# Altium project ANTS-PCU-B1.PrjPcb (part 2 of 2)

## Sheet POWER_RAIL_MONITORING.SchDoc
size B
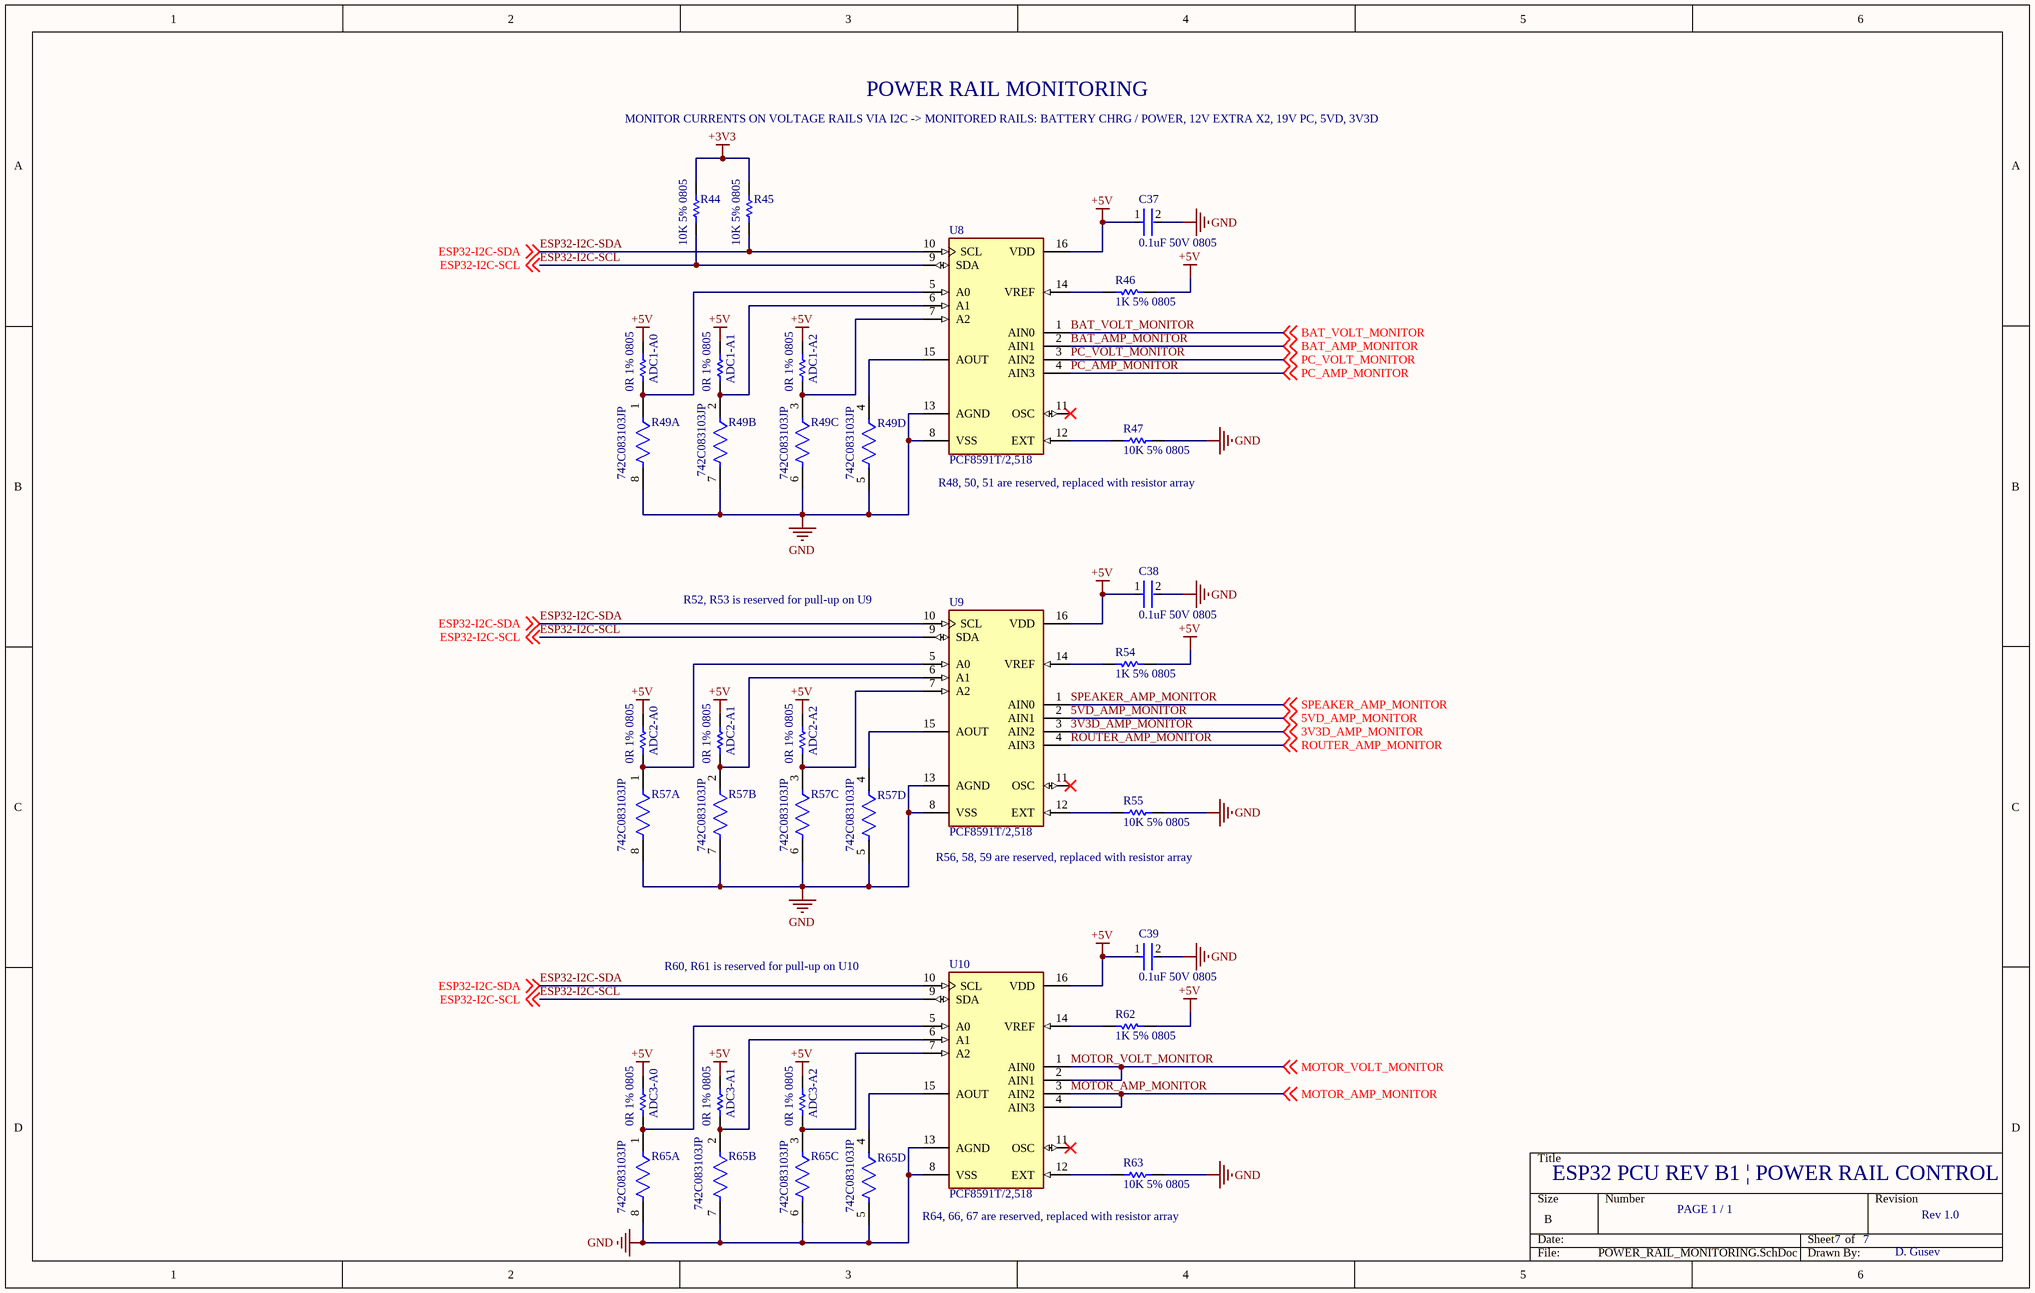
[diagram p6: POWER_RAIL_MONITORING.SchDoc]

### Parts
ADC1-A0  0R 1% 0805  [RESC2013X60X35LL10T20]
ADC1-A1  0R 1% 0805  [RESC2013X60X35LL10T20]
ADC1-A2  0R 1% 0805  [RESC2013X60X35LL10T20]
ADC2-A0  0R 1% 0805  [RESC2013X60X35LL10T20]
ADC2-A1  0R 1% 0805  [RESC2013X60X35LL10T20]
ADC2-A2  0R 1% 0805  [RESC2013X60X35LL10T20]
ADC3-A0  0R 1% 0805  [RESC2013X60X35LL10T20]
ADC3-A1  0R 1% 0805  [RESC2013X60X35LL10T20]
ADC3-A2  0R 1% 0805  [RESC2013X60X35LL10T20]
C37  0.1uF 50V 0805  [FP-C0805C-DN-MFG]
C38  0.1uF 50V 0805  [FP-C0805C-DN-MFG]
C39  0.1uF 50V 0805  [FP-C0805C-DN-MFG]
R44  10K 5% 0805  [RESC2013X60X40ML20T25]
R45  10K 5% 0805  [RESC2013X60X40ML20T25]
R46  1K 5% 0805  [RESC2013X60X40ML20T25]
R47  10K 5% 0805  [RESC2013X60X40ML20T25]
R49  742C083103JP  [FP-742C083-MFG]  (parts A,B,C,D of 4)
R54  1K 5% 0805  [RESC2013X60X40ML20T25]
R55  10K 5% 0805  [RESC2013X60X40ML20T25]
R57  742C083103JP  [FP-742C083-MFG]  (parts A,B,C,D of 4)
R62  1K 5% 0805  [RESC2013X60X40ML20T25]
R63  10K 5% 0805  [RESC2013X60X40ML20T25]
R65  742C083103JP  [FP-742C083-MFG]  (parts A,B,C,D of 4)
U8  PCF8591T/2,518  [FP-SOT162-1-MFG]
U9  PCF8591T/2,518  [FP-SOT162-1-MFG]
U10  PCF8591T/2,518  [FP-SOT162-1-MFG]

### Nets
+3V3: R44.2 R45.2
+5V: ADC1-A0.1 ADC1-A1.1 ADC1-A2.1 ADC2-A0.1 ADC2-A1.1 ADC2-A2.1 ADC3-A0.1 ADC3-A1.1 ADC3-A2.1 C37.1 C38.1 C39.1 R46.2 R54.2 R62.2 U8.16(VDD) U9.16(VDD) U10.16(VDD)
GND: C37.2 C38.2 C39.2 R47.2 R49.5 R49.6 R49.7 R49.8 R55.2 R57.5 R57.6 R57.7 R57.8 R63.2 R65.5 R65.6 R65.7 R65.8 U8.8(VSS) U8.13(AGND) U9.8(VSS) U9.13(AGND) U10.8(VSS) U10.13(AGND)
3V3D_AMP_MONITOR: U9.3(AIN2) ; off-sheet 3V3D_AMP_MONITOR
5VD_AMP_MONITOR: U9.2(AIN1) ; off-sheet 5VD_AMP_MONITOR
BAT_AMP_MONITOR: U8.2(AIN1) ; off-sheet BAT_AMP_MONITOR
BAT_VOLT_MONITOR: U8.1(AIN0) ; off-sheet BAT_VOLT_MONITOR
ESP32-I2C-SCL: R44.1 U8.9(SDA) U9.9(SDA) U10.9(SDA) ; off-sheet ESP32-I2C-SCL
ESP32-I2C-SDA: R45.1 U8.10(SCL) U9.10(SCL) U10.10(SCL) ; off-sheet ESP32-I2C-SDA
MOTOR_AMP_MONITOR: U10.3(AIN2) U10.4(AIN3) ; off-sheet MOTOR_AMP_MONITOR
MOTOR_VOLT_MONITOR: U10.1(AIN0) U10.2(AIN1) ; off-sheet MOTOR_VOLT_MONITOR
PC_AMP_MONITOR: U8.4(AIN3) ; off-sheet PC_AMP_MONITOR
PC_VOLT_MONITOR: U8.3(AIN2) ; off-sheet PC_VOLT_MONITOR
ROUTER_AMP_MONITOR: U9.4(AIN3) ; off-sheet ROUTER_AMP_MONITOR
SPEAKER_AMP_MONITOR: U9.1(AIN0) ; off-sheet SPEAKER_AMP_MONITOR
NetADC1-A0_2: ADC1-A0.2 R49.1 U8.5(A0)
NetADC1-A1_2: ADC1-A1.2 R49.2 U8.6(A1)
NetADC1-A2_2: ADC1-A2.2 R49.3 U8.7(A2)
NetADC2-A0_2: ADC2-A0.2 R57.1 U9.5(A0)
NetADC2-A1_2: ADC2-A1.2 R57.2 U9.6(A1)
NetADC2-A2_2: ADC2-A2.2 R57.3 U9.7(A2)
NetADC3-A0_2: ADC3-A0.2 R65.1 U10.5(A0)
NetADC3-A1_2: ADC3-A1.2 R65.2 U10.6(A1)
NetADC3-A2_2: ADC3-A2.2 R65.3 U10.7(A2)
NetR46_1: R46.1 U8.14(VREF)
NetR47_1: R47.1 U8.12(EXT)
NetR49_4: R49.4 U8.15(AOUT)
NetR54_1: R54.1 U9.14(VREF)
NetR55_1: R55.1 U9.12(EXT)
NetR57_4: R57.4 U9.15(AOUT)
NetR62_1: R62.1 U10.14(VREF)
NetR63_1: R63.1 U10.12(EXT)
NetR65_4: R65.4 U10.15(AOUT)

Not connected (* = marked no-connect by the designer): U8 11(OSC)*; U9 11(OSC)*; U10 11(OSC)*

### Notes on the sheet
- POWER RAIL MONITORING
- MONITOR CURRENTS ON VOLTAGE RAILS VIA I2C -> MONITORED RAILS: BATTERY CHRG / POWER, 12V EXTRA X2, 19V PC, 5VD, 3V3D
- R48, 50, 51 are reserved, replaced with resistor array
- (near U9) R52, R53 is reserved for pull-up on U9
- R56, 58, 59 are reserved, replaced with resistor array
- (near U10) R60, R61 is reserved for pull-up on U10
- R64, 66, 67 are reserved, replaced with resistor array
- ESP32 PCU REV B1 | POWER RAIL CONTROL
- PAGE 1 / 1
- 7
- Rev 1.0
- D. Gusev

### Library data of the parts
ADC1-A0-ADC1-A2 ADC2-A0-ADC2-A2 ADC3-A0-ADC3-A2 = CMP-1659-00014-4: Chip Resistor, 1 Ohm, +/- 1%, 125 mW, -55 to 155 degC, 0805 (2012 Metric), RoHS, Tape and Reel; Manufacturer: Yageo; Voltage Rating: 150 V; REACH SVHC: No SVHC; Mounting Technology: Surface Mount; RoHSCompliant: true; Packaging: Tape and Reel; ComponentLink2URL: http://www.yageo.com/documents/recent/PYu-RC_Group_51_RoHS_L_04.pdf; Pins: 2; Package Quantity: 5000; DatasheetVersion: Rev. 4, 02/2016; Mount: Surface Mount; Max Operating Temperature: 155 degC; PackageDescription: 2-Pin Surface Mounted Device, Body 2 x 1.25 mm; PackageReference: 0805; Length: 2 mm; Min Operating Temperature: -55 degC; ComponentLink1URL: http://www.yageo.com/; Height: 0.5 mm; ComponentLink1Description: Manufacturer URL; ComponentLink2Description: Datasheet
C37-C39 = CMP-2007-00279-2: CAP CER 0.1UF 50V X7R 0805; Manufacturer Part Number: C0805C104K5RACTU; Manufacturer: KEMET; Value: 0.10 μF; Tolerance: 0.1; Temperature Coefficient: 30ppm/°C; Material: Ceramic; Device Class L2: Capacitors; Temperature Range Low: -55°C; Voltage Rating: 50 V; Digikey Description: CAP CER 0.1UF 50V X7R 0805; Category: Cap; ComponentLink2Description: Datasheet; Octopart: https://octopart.com/c0805c104k5ractu-kemet-143926; RoHS: TRUE; ComponentLink2URL: https://content.kemet.com/datasheets/KEM_C1003_C0G_SMD.pdf; Temperature Characteristic: X7R; Temperature: -55°C to +125°C; Height: 0.88mm; Temperature Range High: +125°C; Device Class L1: Passive Components; Automotive: No; Lead Free: Yes; Ipc Land Pattern Name: CAPC200125X78; Device Class L3: Ceramic Capacitors; Mouser Description: Cap Ceramic 0.1uF 50V X7R 10% SMD 2.0 x 1.2 mm 125 C Paper T/R; Capacitance: 0.10 μF; Package: C0805C-DN
R44-R47 R54 R55 R62 R63 = CMP-2001-00590-1: Part Number: ERA6AEB123V; Manufacturer: Panasonic
R49 R57 R65 = CMP-06828-000005-1: RES ARRAY 4 RES 10K OHM 1206; Number of Elements: 4; Circuit Type: Isolated; Power Rating: 250mW; Working Voltage: 50V; Temperature Coefficient: 200ppm/°C; Tolerance: 5%; Resistance: 10kR; Power Per Element: 62.5mW; Power Dissipation: 63mW; Min Operating Temperature: -55°C; Height: 0.028inch; Number of Terminals: 8; Width: 0.063inch; Depth: 1.6mm; Max Operating Temperature: 125°C; Termination: Concave; Lead Free: Lead Free; Mount: Surface Mount; Package Quantity: 1; Military Standard: Not; Radiation Hardening: No; Contact Plating: Tin; Case Code (Metric): 3216; Terminal Pitch: 0.8mm; Number of Pins: 8; Case/Package: 0603; Case Code (Imperial): 1206; Length: 3.2mm; Packaging: Tape and Reel; Number of Resistors: 4
U8-U10 = CMP-10085-000001-1: IC ADC/DAC 8BIT 11.1K 16SO; Manufacturer: NXP Semiconductors; Standoff Height: 0.1mm; Interface: I2C; Nominal Supply Current: 125-450uA; Max Supply Voltage: 6V; Min Supply Voltage: 2.5V; Octopart: https://octopart.com/pcf8591t%2F2%2C518-nxp+semiconductors-7871876; Lead Free: Yes; Mouser Description: PCF8591 Series 2.5 V - 6 V 8-bit A/D and D/A converter - SOIC-16; Package: SOT162-1; Automotive: No; Temperature Range High: +85°C; Ambient Temperature Range High: +85°C; Ambient Temperature Range Low: -40°C; Temperature Range Low: -40°C; Temperature: -40°C to +85°C; Manufacturer Part Number: PCF8591T/2,518; Device Class L2: Data Converter ICs; Device Class L1: Integrated Circuits (ICs); Height: 2.65mm; ComponentLink2URL: https://www.nxp.com/docs/en/data-sheet/PCF8591.pdf; Digikey Description: IC ADC/DAC 8BIT 11.1K 16SO; Ipc Land Pattern Name: SOIC127P1032X265-16; Device Class L3: unset; Footprint Url: https://www.nxp.com/docs/en/package-information/SOT162-1.pdf; RoHS: TRUE; Category: IC; ComponentLink2Description: Datasheet

## Sheet 19V-PC-POWER.SchDoc
size B
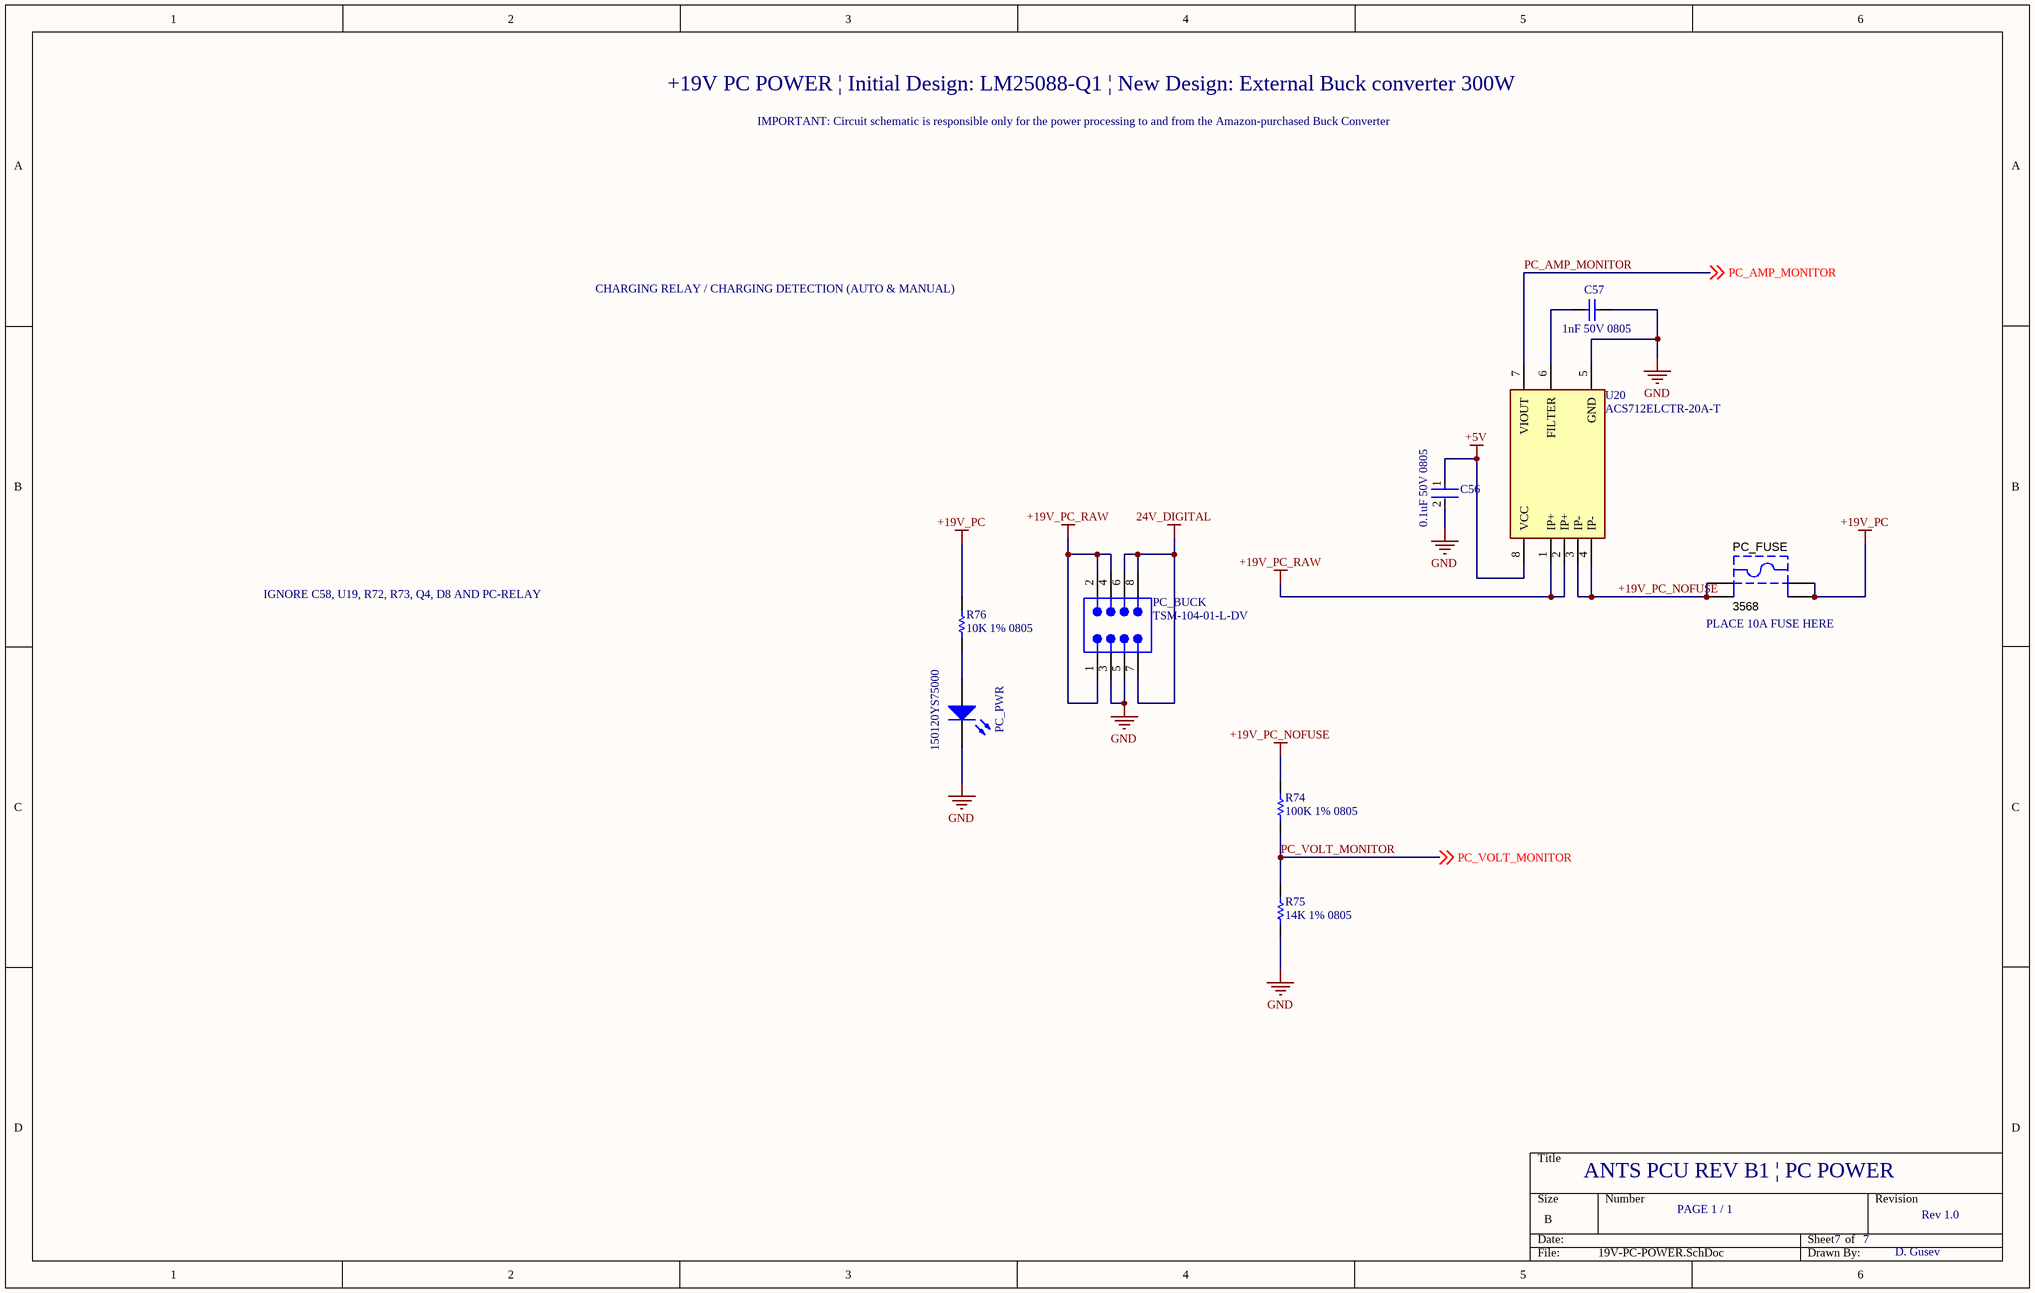
[diagram p7: 19V-PC-POWER.SchDoc]

### Parts
C56  0.1uF 50V 0805  [FP-C0805C-DN-MFG]
C57  1nF 50V 0805  [CAPC2013X94X50ML20T25]
PC_BUCK  TSM-104-01-L-DV  [SMTC-TSM-104-01-X-DV]
PC_FUSE  3568  [KSTN-3568_V]
PC_PWR  150120YS75000  [1206_A]
R74  100K 1% 0805  [RESC2013X60X35ML10T20]
R75  14K 1% 0805  [RESC2013X60X35LL10T20]
R76  10K 1% 0805  [RESC2013X60X35NL10T20]
U20  ACS712ELCTR-20A-T  [FP-LC-8-IPC_C]

### Nets
24V_DIGITAL: PC_BUCK.6 PC_BUCK.7 PC_BUCK.8  [project net +24V_DIGITAL]
+5V: C56.1 U20.8(VCC)
+19V_PC: PC_FUSE.1 PC_FUSE.2 R76.1
+19V_PC_NOFUSE: PC_FUSE.3 PC_FUSE.4 R74.2 U20.3(IP-) U20.4(IP-)
+19V_PC_RAW: PC_BUCK.1 PC_BUCK.2 PC_BUCK.4 U20.1(IP+) U20.2(IP+)
GND: C56.2 C57.2 PC_BUCK.3 PC_BUCK.5 PC_PWR.1(K) R75.1 U20.5(GND)
PC_AMP_MONITOR: U20.7(VIOUT) ; off-sheet PC_AMP_MONITOR
PC_VOLT_MONITOR: R74.1 R75.2 ; off-sheet PC_VOLT_MONITOR
NetC57_1: C57.1 U20.6(FILTER)
NetPC_PWR_2: PC_PWR.2(A) R76.2

### Notes on the sheet
- +19V PC POWER | Initial Design: LM25088-Q1 | New Design: External Buck converter 300W
- IMPORTANT: Circuit schematic is responsible only for the power processing to and from the Amazon-purchased Buck Converter
- CHARGING RELAY / CHARGING DETECTION (AUTO & MANUAL)
- IGNORE C58, U19, R72, R73, Q4, D8 AND PC-RELAY
- (near PC_FUSE) PLACE 10A FUSE HERE
- ANTS PCU REV B1 | PC POWER
- PAGE 1 / 1
- 7
- Rev 1.0
- D. Gusev

### Library data of the parts
C56 = CMP-2007-00279-2: as C37 on sheet POWER_RAIL_MONITORING; Device Class L2: Capacitors; Temperature Range Low: -55°C; Voltage Rating: 50 V; Digikey Description: CAP CER 0.1UF 50V X7R 0805; Category: Cap; ComponentLink2Description: Datasheet; Octopart: https://octopart.com/c0805c104k5ractu-kemet-143926; RoHS: TRUE; ComponentLink2URL: https://content.kemet.com/datasheets/KEM_C1003_C0G_SMD.pdf; Temperature Characteristic: X7R; Temperature: -55°C to +125°C; Height: 0.88mm; Temperature Range High: +125°C; Device Class L1: Passive Components; Automotive: No; Lead Free: Yes; Ipc Land Pattern Name: CAPC200125X78; Device Class L3: Ceramic Capacitors; Mouser Description: Cap Ceramic 0.1uF 50V X7R 10% SMD 2.0 x 1.2 mm 125 C Paper T/R; Capacitance: 0.10 μF; Package: C0805C-DN
C57 = CMP-1036-02979-2: Part Number: 08055C102KAT2A.; Manufacturer: AVX Interconnect / Elco
PC_BUCK = CMP-1024-00221-1: 0.025" SQ Post Header, Surface Mount, Vertical, -55 to 125 degC, 2.54 mm Pitch, 8-Pin, Male, RoHS; Manufacturer: Samtec; Pitch: 2.54 mm; ComponentLink1URL: http://www.samtec.com; ComponentLink1Description: Manufacturer URL; RoHS: True; ComponentLink3Description: Package Specification; PackageDescription: Double Row Gullwing ASM; DatasheetVersion: F-214; PackageVersion: DJ, 4/1991; PackageReference: TSM-104-01-X-DV; PartNumber: TSM-104-01-L-DV; ComponentLink3URL: http://www.samtec.com/documents/webfiles/cpdf/TSM-1XX-XX-XXX-XX-X-XXX-X-MKT.pdf; Temperature Range: -55 to 125 degC; ComponentLink2Description: Datasheet; Mounting Technology: Surface Mount; ComponentLink2URL: http://www.samtec.com/documents/webfiles/pdf/TSM.PDF; Orientation: Vertical
PC_FUSE = CMP-2000-05464-1: Fuse Holder, 20 A, 500 V, -50 to 145 degC, 4-Pin THD, RoHS; Manufacturer: Keystone; Package Reference: 3568; Datasheet Version: 04/2013; Datasheet URL: https://datasheet.ciiva.com/16294/m60-2p40-16294706.pdf; Manufacturer URL: http://www.keyelco.com/; Mounting Technology: ThroughHole; Package Description: 4-Pin Through Hole Device, Body 16 x 6.73 mm, Pitch 9.9 mm
PC_PWR = CMP-1426-00019-1: SMD mono-color Chip LED, WL-SMCW, Yellow; Manufacturer: Wuerth Elektronik; ComponentLink2URL: http://katalog.we-online.com/led/datasheet/150120YS75000.pdf; PartNumber: 150120YS75000; ComponentLink1URL: http://www.we-online.com; Color: Yellow; ComponentLink1Description: Manufacturer URL; PackageReference: 1206_A; ComponentLink2Description: Datasheet
R74 = CMP-2100-03668-1: Chip Resistor, 100 KOhm, +/- 1%, 0.125 W, -55 to 155 degC, 0805 (2012 Metric), RoHS, Tape and Reel; Manufacturer: Yageo; Max Power Dissipation: 125mW; Voltage Rating: 150V; Temperature Coefficient: 100ppm/degreesC; Manufacturer URL: http://www.yageo.com/; Min Operating Temperature: -55degC; Lead Pitch: 0.4mm; Composition: ThickFilm; Case Code (Metric): 2012; Military Standard: Not; Package Description: 2-Pin Surface Mounted Device, Body 2 x 1.25 mm; REACH SVHC: Unknown; RoHSCompliant: true; Depth: 1.25mm; Number of Pins: 2; Lead Free: LeadFree; Resistance: 100KOhm; Datasheet URL: http://www.yageo.com/NewPortal/yageodocoutput?fileName=/pdf/R-Chip/PYu-RC_Group_51_RoHS_L_5.pdf; Max Operating Temperature: 155degC; Case/Package: 0805; Package Quantity: 1; Case Code (Imperial): 0805; Power Rating: 125mW; Width: 0.049inch; Package Reference: 0805; Height: 0.024inch; Termination: SMD/SMT; Tolerance: 1%; Datasheet Version: Rev. 5, 10/2016; Length: 2mm; Voltage Rating (DC): 150V; Number of Terminations: 2; Packaging: TapeandReel
R75 = CMP-1013-00638-2: Part Number: RC0805FR-0714KL; Manufacturer: Yageo
R76 = CMP-1659-00013-4: Chip Resistor, 10 KOhm, +/- 1%, 0.125 W, -55 to 155 degC, 0805 (2012 Metric), RoHS, Tape and Reel; Manufacturer: Yageo; Voltage Rating: 150 V; Mount: Surface Mount; ComponentLink1Description: Manufacturer URL; ComponentLink2URL: http://www.yageo.com/documents/recent/PYu-RC_Group_51_RoHS_L_04.pdf; Pins: 2; Length: 2 mm; Min Operating Temperature: -55 degC; Height: 0.5 mm; Mounting Technology: Surface Mount; RoHSCompliant: true; REACH SVHC: No SVHC; ComponentLink1URL: http://www.yageo.com/; Max Operating Temperature: 155 degC; PackageReference: 0805; DatasheetVersion: Rev. 4, 02/2016; Package Quantity: 5000; Packaging: Tape and Reel; ComponentLink2Description: Datasheet; PackageDescription: 2-Pin Surface Mounted Device, Body 2 x 1.25 mm
U20 = CMP-0826-00001-2: SENSOR CURRENT HALL 20A AC/DC; Accuracy: 1.5%; Quiescent Current: 10mA; Response Time: 5us; Sensitivity: 100mV/A; Min Supply Voltage: 4.5V; Number of Channels: 1; Polarity: Bidirectional; Frequency: 80kHz; Max Supply Current: 13mA; Operating Supply Voltage: 5V; Max Supply Voltage: 5.5V; Max Operating Temperature: 85°C; Case/Package: SOIC; REACH SVHC: No SVHC; Min Operating Temperature: -40°C; Current Sensing: 20A; Packaging: Tape and Reel; Lead Free: Lead Free; Series: -; Length: 4.9mm; Number of Pins: 8; Linearity: 1.5%; Radiation Hardening: No; Package Quantity: 1; Termination: SMD/SMT; Output Current: 10mA; Height: 1.5mm; RoHS Compliant: Yes; Width: 3.9mm; Bandwidth: 80kHz

## Sheet 12V-EXTRA-POWER.SchDoc
size B
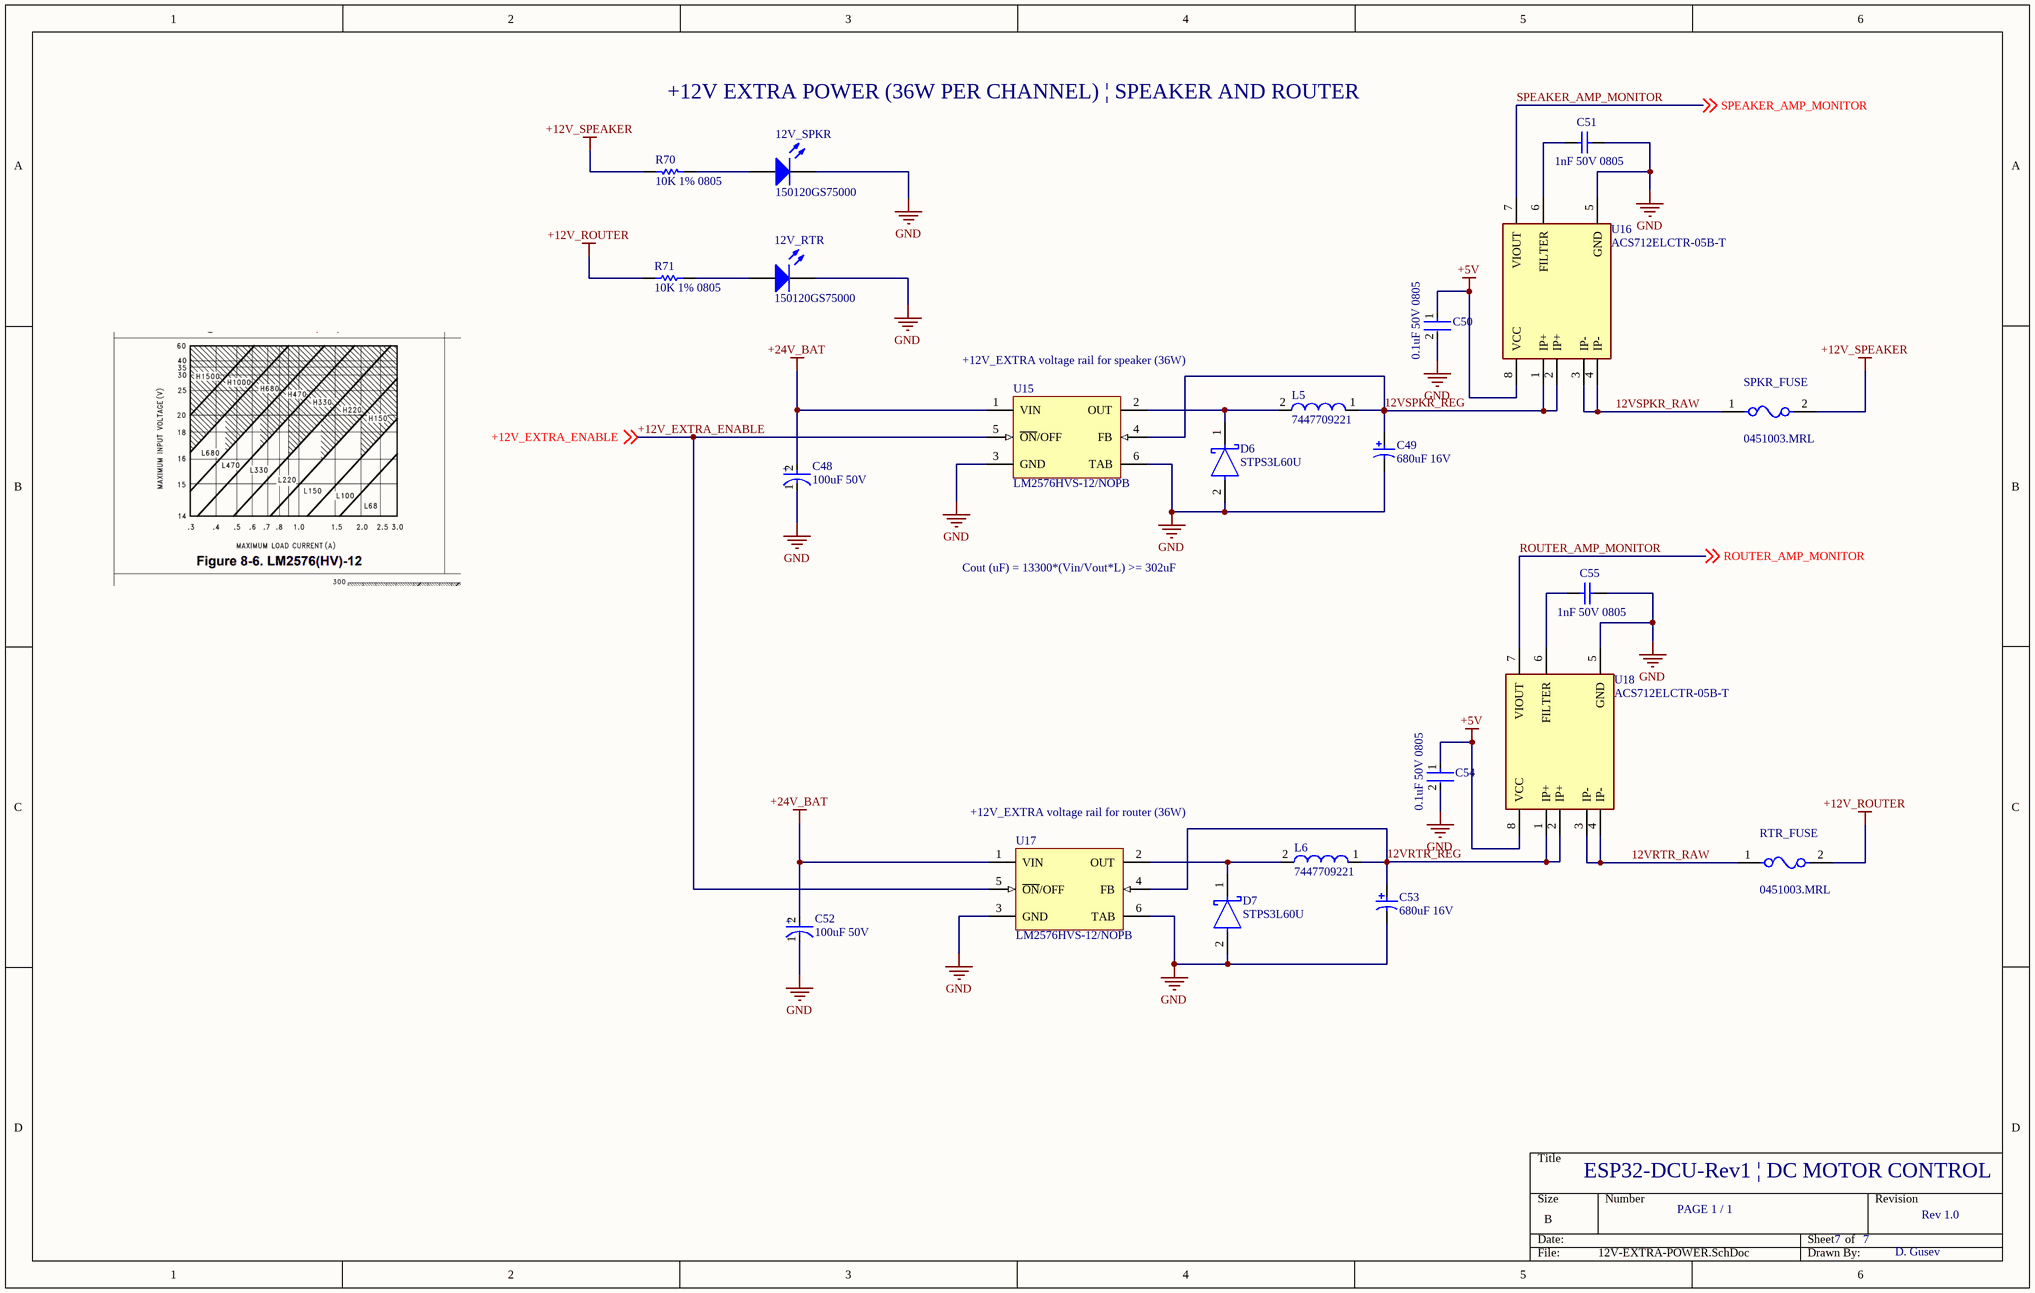
[diagram p8: 12V-EXTRA-POWER.SchDoc]

### Parts
12V_RTR  150120GS75000  [1206_A]
12V_SPKR  150120GS75000  [1206_A]
C48  100uF 50V  [FP-EEE-FK1H101P-MFG]
C49  680uF 16V  [NIC-CAPA2-10X10_V]
C50  0.1uF 50V 0805  [FP-C0805C-DN-MFG]
C51  1nF 50V 0805  [CAPC2013X94X50ML20T25]
C52  100uF 50V  [FP-EEE-FK1H101P-MFG]
C53  680uF 16V  [NIC-CAPA2-10X10_V]
C54  0.1uF 50V 0805  [FP-C0805C-DN-MFG]
C55  1nF 50V 0805  [CAPC2013X94X50ML20T25]
D6  STPS3L60U  [FP-SMB-MFG]
D7  STPS3L60U  [FP-SMB-MFG]
L5  7447709221  [WE-PD-XXL]
L6  7447709221  [WE-PD-XXL]
R70  10K 1% 0805  [RESC2013X60X35NL10T20]
R71  10K 1% 0805  [RESC2013X60X35NL10T20]
RTR_FUSE  0451003.MRL  [FP-0451-MFG]
SPKR_FUSE  0451003.MRL  [FP-0451-MFG]
U15  LM2576HVS-12/NOPB  [KTT0005B_N]
U16  ACS712ELCTR-05B-T  [FP-LC-8-IPC_A]
U17  LM2576HVS-12/NOPB  [KTT0005B_N]
U18  ACS712ELCTR-05B-T  [FP-LC-8-IPC_A]

### Nets
+5V: C50.1 C54.1 U16.8(VCC) U18.8(VCC)
+12V_ROUTER: R71.2 RTR_FUSE.2
+12V_SPEAKER: R70.2 SPKR_FUSE.2
+24V_BAT: C48.2(A) C52.2(A) U15.1(VIN) U17.1(VIN)
GND: 12V_RTR.1(K) 12V_SPKR.1(K) C48.1(C) C49.2 C50.2 C51.2 C52.1(C) C53.2 C54.2 C55.2 D6.2(A) D7.2(A) U15.3(GND) U15.6(TAB) U16.5(GND) U17.3(GND) U17.6(TAB) U18.5(GND)
12VRTR_RAW: RTR_FUSE.1 U18.3(IP-) U18.4(IP-)
12VRTR_REG: C53.1 L6.1 U17.4(FB) U18.1(IP+) U18.2(IP+)
12VSPKR_RAW: SPKR_FUSE.1 U16.3(IP-) U16.4(IP-)
12VSPKR_REG: C49.1 L5.1 U15.4(FB) U16.1(IP+) U16.2(IP+)
+12V_EXTRA_ENABLE: U15.5(~{ON}/OFF) U17.5(~{ON}/OFF) ; off-sheet +12V_EXTRA_ENABLE
ROUTER_AMP_MONITOR: U18.7(VIOUT) ; off-sheet ROUTER_AMP_MONITOR
SPEAKER_AMP_MONITOR: U16.7(VIOUT) ; off-sheet SPEAKER_AMP_MONITOR
Net12V_RTR_2: 12V_RTR.2(A) R71.1
Net12V_SPKR_2: 12V_SPKR.2(A) R70.1
NetC51_1: C51.1 U16.6(FILTER)
NetC55_1: C55.1 U18.6(FILTER)
NetD6_1: D6.1(K) L5.2 U15.2(OUT)
NetD7_1: D7.1(K) L6.2 U17.2(OUT)

### Notes on the sheet
- +12V EXTRA POWER (36W PER CHANNEL) | SPEAKER AND ROUTER
- (near U15) +12V_EXTRA voltage rail for speaker (36W)
- Cout (uF) = 13300*(Vin/Vout*L) >= 302uF
- (near U17) +12V_EXTRA voltage rail for router (36W)
- ESP32-DCU-Rev1 | DC MOTOR CONTROL
- PAGE 1 / 1
- 7
- Rev 1.0
- D. Gusev
- (in symbol CMP-2000-06208-2) +

### Library data of the parts
12V_RTR 12V_SPKR = CMP-1426-00014-1: SMD mono-color Chip LED, WL-SMCW, Green; Manufacturer: Wuerth Elektronik; PackageReference: 1206_A; PartNumber: 150120GS75000; ComponentLink1Description: Manufacturer URL; ComponentLink2URL: http://katalog.we-online.com/led/datasheet/150120GS75000.pdf; ComponentLink2Description: Datasheet; Color: Green; ComponentLink1URL: http://www.we-online.com
C48 C52 = CMP-2000-06208-2: CAP ALUM 100UF 20% 50V SMD; Manufacturer Part Number: EEE-FK1H101P; Manufacturer: Panasonic Electronic Components; Automotive Grade: Grade 2; Dissipation Factor: 10%; Life: 2000Hours; Ripple Current: 350mA; Material: Aluminum; Esr: 0.34Ω; Leakage Current: 50uA; Tolerance: 20%; Package: 0; ComponentLink2URL: https://industrial.panasonic.com/cdbs/www-data/pdf/RDE0000/ABA0000C1181.pdf; Temperature Range Low: -55°C; Voltage Rating: 50V; ComponentLink2Description: Datasheet; Category: Cap; Digikey Description: CAP ALUM 100UF 20% 50V SMD; Octopart: https://octopart.com/eeefk1h101p-panasonic-4642841; Automotive: Yes; Temperature: -55°C to +105°C; Capacitance: 100uF; Lead Free: Yes; Mouser Description: Cap Aluminum Lytic 100uF 50V 20% (8 X 10.2mm) SMD 350mA 2000h 105C Automotive T/R; Height: 10.5mm; Device Class L3: Aluminum Electrolytic Capacitors; Value: 100uF; Device Class L1: Passive Components; RoHS: TRUE; Device Class L2: Capacitors; Temperature Range High: +105°C
C49 C53 = CMP-0687-00005-1: Aluminum Electrolytic Capacitor, UD Series, Low Impedance, 680 uF, 16 V, + / - 20%, -55 to 105 degC, Chip Type, 10 x 10 mm D x L, Pb-Free, Reel; Manufacturer: Nichicon; PartNumber: UUD1C681MNL1GS; Packing: Dia382mm Reel; Tolerance Rated Capacitance: -20 to 20%; Rated Ripple Current (at 100kHz): 670 mA; Endurance Time: 5000 h; Impedance: 0.09 Ohm; ComponentLink1Description: Manufacturer URL; RoHS: TRUE; ComponentLink2Description: Datasheet; ComponentLink1URL: http://www.nichicon.co.jp/; ComponentLink3URL: http://products.nichicon.co.jp/en/pdf/XJA043/e-ud.pdf; ComponentLink3Description: Package Specification; PackageDescription: 2-Pin Surface Mount Device, Diameter 10 mm, Height 10 mm, Pitch 8 mm; Rated Capacitance: 680 uF; Length: 10 mm; Diameter: 10 mm; Mounting Technology: Surface Mount; Rated Voltage: 16 V; ComponentLink2URL: http://products.nichicon.co.jp/en/pdf/XJA043/e-ud.pdf; DatasheetVersion: 08/2012; PackageReference: CAPAE-D10H10
C50 C54 = CMP-2007-00279-2: as C37 on sheet POWER_RAIL_MONITORING; Device Class L2: Capacitors; Temperature Range Low: -55°C; Voltage Rating: 50 V; Digikey Description: CAP CER 0.1UF 50V X7R 0805; Category: Cap; ComponentLink2Description: Datasheet; Octopart: https://octopart.com/c0805c104k5ractu-kemet-143926; RoHS: TRUE; ComponentLink2URL: https://content.kemet.com/datasheets/KEM_C1003_C0G_SMD.pdf; Temperature Characteristic: X7R; Temperature: -55°C to +125°C; Height: 0.88mm; Temperature Range High: +125°C; Device Class L1: Passive Components; Automotive: No; Lead Free: Yes; Ipc Land Pattern Name: CAPC200125X78; Device Class L3: Ceramic Capacitors; Mouser Description: Cap Ceramic 0.1uF 50V X7R 10% SMD 2.0 x 1.2 mm 125 C Paper T/R; Capacitance: 0.10 μF; Package: C0805C-DN
C51 C55 = CMP-1036-02979-2: as C57 on sheet 19V-PC-POWER
D6 D7 = CMP-12187-000023-1: DIODE SCHOTTKY 60V 3A SMB; Manufacturer: STMicroelectronics; Standoff Height: 0.05mm; Peak Reverse Current: 150uA; Max Junction Temp: +150°C; Max Surge Forward Current: 100A; Octopart: https://octopart.com/stps3l60u-stmicroelectronics-334329; Category: Diode; Height: 2.65mm; RoHS: TRUE; Mouser Description: Schottky diode Configuration: Single Housing type: DO-214AA=SMB Peak conducting-state current: 100 A; Forward Current: 3A; Manufacturer Part Number: STPS3L60U; Temperature: to +150°C; ComponentLink2URL: https://www.st.com/resource/en/datasheet/stps3l60.pdf; Max Repetitive Reverse Voltage: 60V; Device Class L1: Discrete Semiconductors; Automotive: No; Device Class L3: Schottky Diodes; Digikey Description: DIODE SCHOTTKY 60V 3A SMB; Lead Free: Yes; Temperature Range High: +150°C; Package: SMB; ComponentLink2Description: Datasheet; Device Class L2: Diodes
L5 L6 = CMP-0227-00173-1: SMD-Shielded Power Inductor WE-PD, L = 220 µH; Inductance: 220 ÂµH; PackageReference: WE-PD-XXL; ComponentLink1URL: http://www.we-online.com; PackageDescription: SMD Inductor, 2-Leads, Body 12.0 x 12.0 mm; ComponentLink2URL: http://www.we-online.de/katalog/media/pdf/7447709221.pdf; DatasheetVersion: ver 1, Oct-2004; ComponentLink2Description: Datasheet; PackageVersion: 2004; ComponentLink1Description: Manufacturer Link
R70 R71 = CMP-1659-00013-4: as R76 on sheet 19V-PC-POWER; Mount: Surface Mount; ComponentLink1Description: Manufacturer URL; ComponentLink2URL: http://www.yageo.com/documents/recent/PYu-RC_Group_51_RoHS_L_04.pdf; Pins: 2; Length: 2 mm; Min Operating Temperature: -55 degC; Height: 0.5 mm; Mounting Technology: Surface Mount; RoHSCompliant: true; REACH SVHC: No SVHC; ComponentLink1URL: http://www.yageo.com/; Max Operating Temperature: 155 degC; PackageReference: 0805; DatasheetVersion: Rev. 4, 02/2016; Package Quantity: 5000; Packaging: Tape and Reel; ComponentLink2Description: Datasheet; PackageDescription: 2-Pin Surface Mounted Device, Body 2 x 1.25 mm
RTR_FUSE SPKR_FUSE = CMP-08605-000063-1: FUSE BRD MNT 3A 125VAC/VDC 2SMD; Manufacturer: Littelfuse Inc; Fuse Interrupt Ac Current: 50A; Voltage Rating: 125V; Fuse I2T: 1.65A2Sec; Resistance: 0.0227Ω; Fuse Blow Speed: Fast; Value: 0.0227Ω; RoHS: TRUE; Automotive: No; Max Fuse Dc Voltage: 125V; Mouser Description: Surface Mount Fuses 125V 3A; Package: 0451; Device Class L2: Fuses; Fuse Current: 3A; Manufacturer Part Number: 0451003.MRL; ComponentLink2Description: Datasheet; Lead Free: Yes; Temperature Range Low: -55°C; Max Fuse Ac Voltage: 125V; Temperature: -55°C to +125°C; Device Class L1: Circuit Protection; Octopart: https://octopart.com/0451003.mrl-littelfuse-566380; Category: Fuse; Height: 2.94mm; Temperature Range High: +125°C; ComponentLink2URL: https://www.littelfuse.com/~/media/electronics/datasheets/fuses/littelfuse_fuse_451_453_datasheet.pdf.pdf; Digikey Description: FUSE BRD MNT 3A 125VAC/VDC 2SMD; Device Class L3: unset; Fuse Interrupt Dc Current: 50A
U15 U17 = CMP-0069-00133-3: SIMPLE SWITCHER® 3A Step-Down Voltage Regulator, 5-pin TO-263, Pb-Free; Manufacturer: Texas Instruments; PowerWise: N; PackageTopMarking: NSUZXYTTE#*LM2576*HVS-12 P+; RoHS: Y; ComponentLink1Description: Datasheet URL; ComponentLink1URL: http://www.ti.com/general/docs/lit/getliterature.tsp?genericPartNumber=LM2576HV&fileType=pdf; PackageReference: KTT0005B; PackageDescription: TO-263, Molded, .400 x .390 x .180in, 5 Lead, .067in Pitch, Surface Mount; PinCount: 5; CompType: Switcher; Code_JEDEC: MO-169-AB
U16 U18 = CMP-2000-04989-2: SENSOR CURRENT HALL 5A AC/DC; Output Current: 10mA; Response Time: 5us; Number of Channels: 1; Sensitivity: 185mV/A; Polarity: Bidirectional; Linearity: 1.5%; Max Supply Current: 13mA; Frequency: 80kHz; Max Supply Voltage: 5.5V; Min Supply Voltage: 4.5V; Voltage: 5V; Mount: Surface Mount; Max Operating Temperature: 85°C; Min Operating Temperature: -40°C; Termination: SMD/SMT; Number of Pins: 8; Accuracy: 1.5%; Current Sensing: 5A; Length: 4.9mm; Package Quantity: 1; REACH SVHC: No SVHC; Packaging: Cut Tape; Series: -; Height: 1.5mm; Width: 3.9mm; Operating Supply Voltage: 5V; Bandwidth: 80kHz; Case/Package: SOIC; Lead Free: Lead Free; Quiescent Current: 10mA; RoHS Compliant: Yes

## Sheet +5V_3V3_DIGITAL.SchDoc
size B
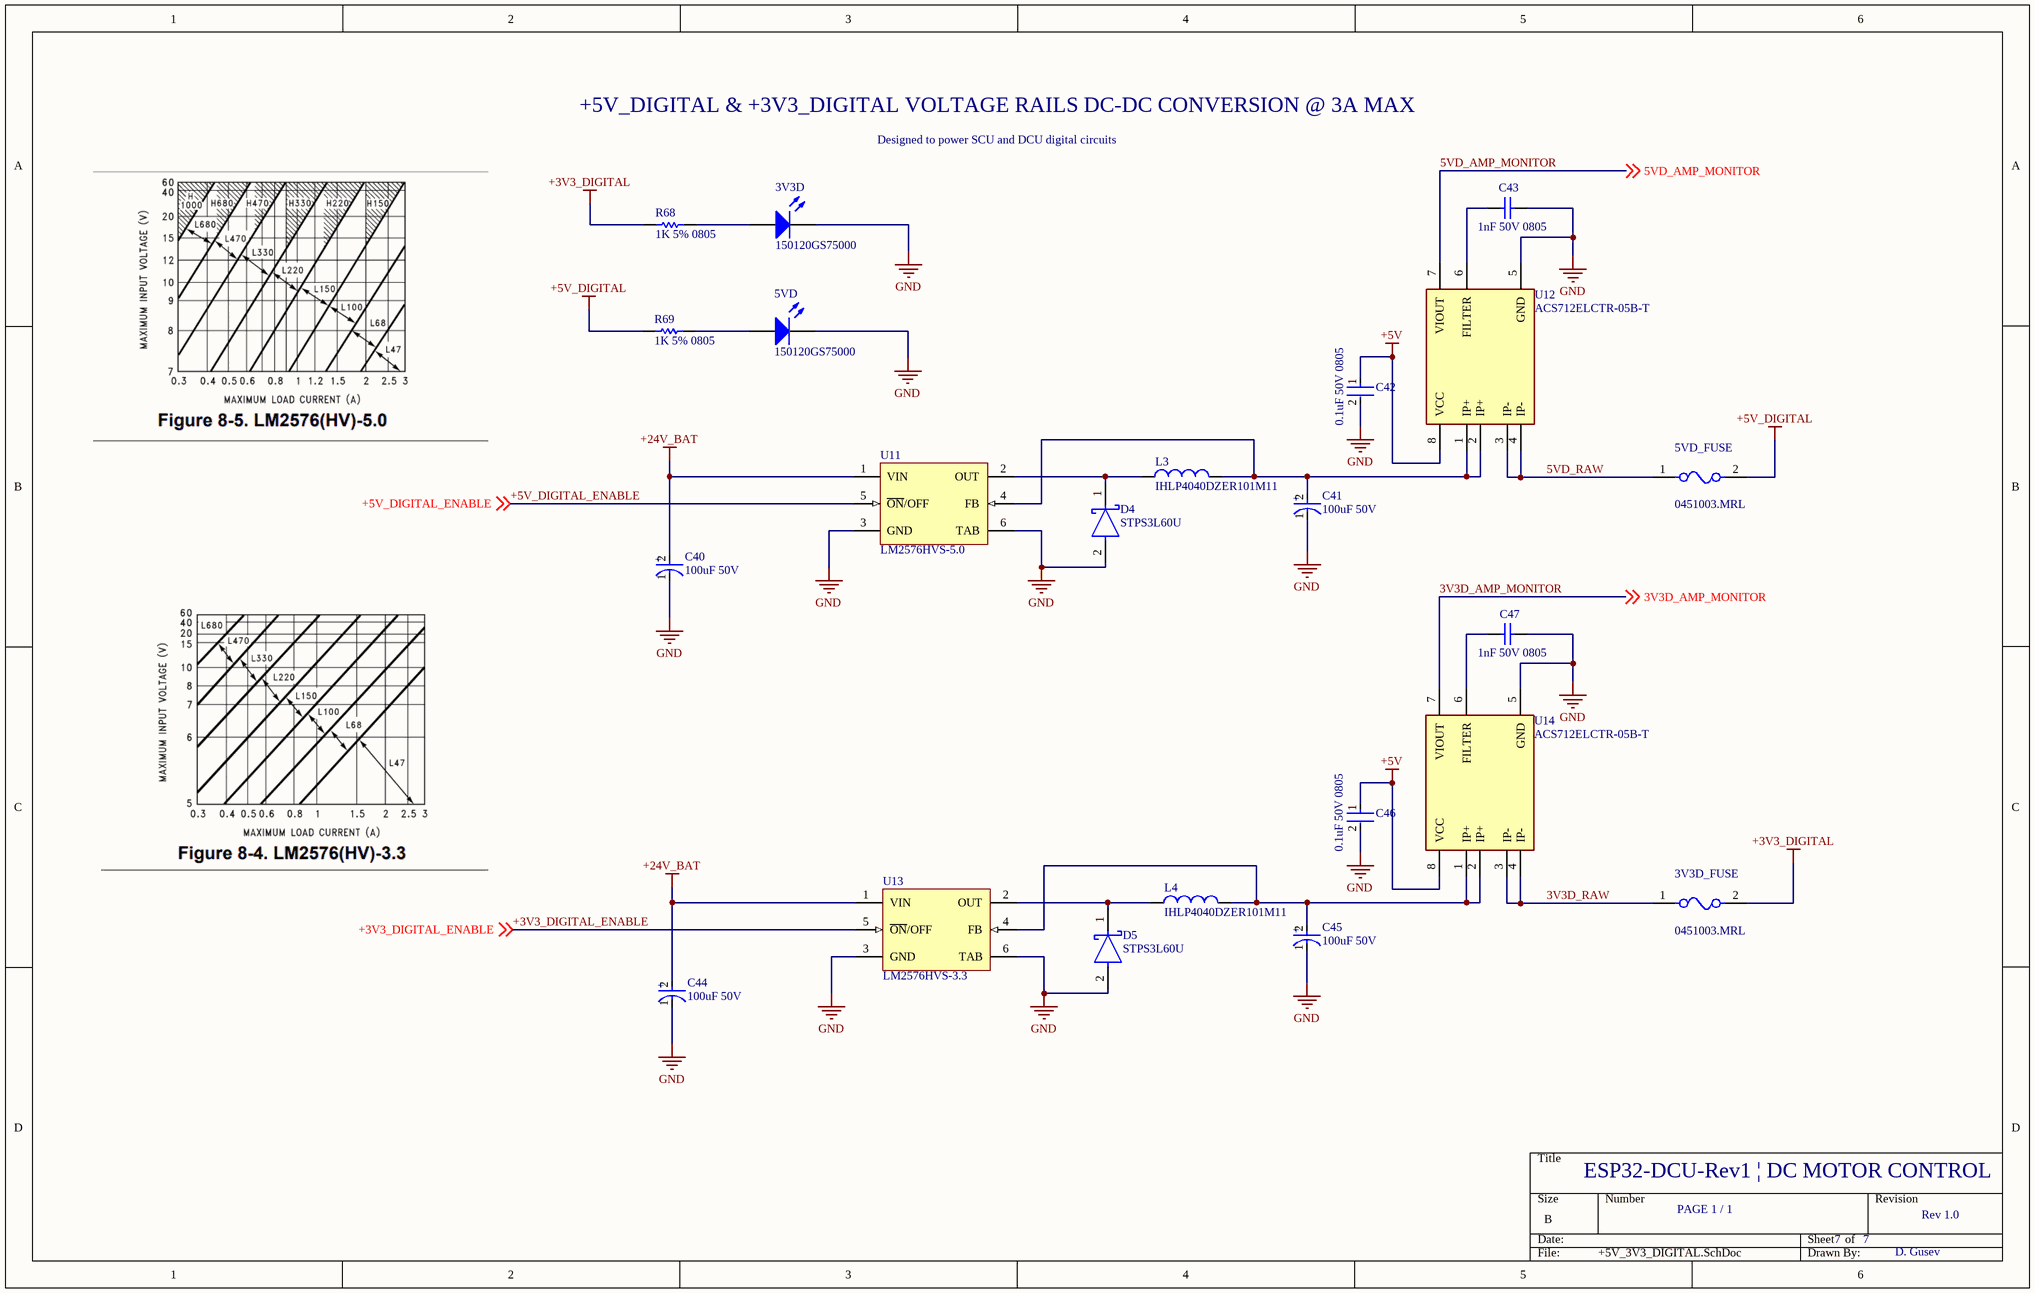
[diagram p9: +5V_3V3_DIGITAL.SchDoc]

### Parts
3V3D  150120GS75000  [1206_A]
3V3D_FUSE  0451003.MRL  [FP-0451-MFG]
5VD  150120GS75000  [1206_A]
5VD_FUSE  0451003.MRL  [FP-0451-MFG]
C40  100uF 50V  [FP-EEE-FK1H101P-MFG]
C41  100uF 50V  [FP-EEE-FK1H101P-MFG]
C42  0.1uF 50V 0805  [FP-C0805C-DN-MFG]
C43  1nF 50V 0805  [CAPC2013X94X50ML20T25]
C44  100uF 50V  [FP-EEE-FK1H101P-MFG]
C45  100uF 50V  [FP-EEE-FK1H101P-MFG]
C46  0.1uF 50V 0805  [FP-C0805C-DN-MFG]
C47  1nF 50V 0805  [CAPC2013X94X50ML20T25]
D4  STPS3L60U  [FP-SMB-MFG]
D5  STPS3L60U  [FP-SMB-MFG]
L3  IHLP4040DZER101M11  [VISH-IHLP4040DZER101M11_V]
L4  IHLP4040DZER101M11  [VISH-IHLP4040DZER101M11_V]
R68  1K 5% 0805  [RESC2013X60X40ML20T25]
R69  1K 5% 0805  [RESC2013X60X40ML20T25]
U11  LM2576HVS-5.0  [KTT0005B_L]
U12  ACS712ELCTR-05B-T  [FP-LC-8-IPC_A]
U13  LM2576HVS-3.3  [KTT0005B_M]
U14  ACS712ELCTR-05B-T  [FP-LC-8-IPC_A]

### Nets
+3V3_DIGITAL: 3V3D_FUSE.2 R68.2
+5V: C42.1 C46.1 U12.8(VCC) U14.8(VCC)
+5V_DIGITAL: 5VD_FUSE.2 R69.2
+24V_BAT: C40.2(A) C44.2(A) U11.1(VIN) U13.1(VIN)
GND: 3V3D.1(K) 5VD.1(K) C40.1(C) C41.1(C) C42.2 C43.2 C44.1(C) C45.1(C) C46.2 C47.2 D4.2(A) D5.2(A) U11.3(GND) U11.6(TAB) U12.5(GND) U13.3(GND) U13.6(TAB) U14.5(GND)
3V3D_AMP_MONITOR: U14.7(VIOUT) ; off-sheet 3V3D_AMP_MONITOR
3V3D_RAW: 3V3D_FUSE.1 U14.3(IP-) U14.4(IP-)
5VD_AMP_MONITOR: U12.7(VIOUT) ; off-sheet 5VD_AMP_MONITOR
5VD_RAW: 5VD_FUSE.1 U12.3(IP-) U12.4(IP-)
+3V3_DIGITAL_ENABLE: U13.5(~{ON}/OFF) ; off-sheet +3V3_DIGITAL_ENABLE
+5V_DIGITAL_ENABLE: U11.5(~{ON}/OFF) ; off-sheet +5V_DIGITAL_ENABLE
Net3V3D_2: 3V3D.2(A) R68.1
Net5VD_2: 5VD.2(A) R69.1
NetC41_2: C41.2(A) L3.2 U11.4(FB) U12.1(IP+) U12.2(IP+)
NetC43_1: C43.1 U12.6(FILTER)
NetC45_2: C45.2(A) L4.1 U13.4(FB) U14.1(IP+) U14.2(IP+)
NetC47_1: C47.1 U14.6(FILTER)
NetD4_1: D4.1(K) L3.1 U11.2(OUT)
NetD5_1: D5.1(K) L4.2 U13.2(OUT)

### Notes on the sheet
- +5V_DIGITAL & +3V3_DIGITAL VOLTAGE RAILS DC-DC CONVERSION @ 3A MAX
- Designed to power SCU and DCU digital circuits
- ESP32-DCU-Rev1 | DC MOTOR CONTROL
- PAGE 1 / 1
- 7
- Rev 1.0
- D. Gusev
- (in symbol CMP-2000-06208-2) +

### Library data of the parts
3V3D 5VD = CMP-1426-00014-1: as 12V_RTR on sheet 12V-EXTRA-POWER; PackageReference: 1206_A; PartNumber: 150120GS75000; ComponentLink1Description: Manufacturer URL; ComponentLink2URL: http://katalog.we-online.com/led/datasheet/150120GS75000.pdf; ComponentLink2Description: Datasheet; Color: Green; ComponentLink1URL: http://www.we-online.com
3V3D_FUSE 5VD_FUSE = CMP-08605-000063-1: as RTR_FUSE on sheet 12V-EXTRA-POWER; RoHS: TRUE; Automotive: No; Max Fuse Dc Voltage: 125V; Mouser Description: Surface Mount Fuses 125V 3A; Package: 0451; Device Class L2: Fuses; Fuse Current: 3A; Manufacturer Part Number: 0451003.MRL; ComponentLink2Description: Datasheet; Lead Free: Yes; Temperature Range Low: -55°C; Max Fuse Ac Voltage: 125V; Temperature: -55°C to +125°C; Device Class L1: Circuit Protection; Octopart: https://octopart.com/0451003.mrl-littelfuse-566380; Category: Fuse; Height: 2.94mm; Temperature Range High: +125°C; ComponentLink2URL: https://www.littelfuse.com/~/media/electronics/datasheets/fuses/littelfuse_fuse_451_453_datasheet.pdf.pdf; Digikey Description: FUSE BRD MNT 3A 125VAC/VDC 2SMD; Device Class L3: unset; Fuse Interrupt Dc Current: 50A
C40 C41 C44 C45 = CMP-2000-06208-2: as C48 on sheet 12V-EXTRA-POWER; Tolerance: 20%; Package: 0; ComponentLink2URL: https://industrial.panasonic.com/cdbs/www-data/pdf/RDE0000/ABA0000C1181.pdf; Temperature Range Low: -55°C; Voltage Rating: 50V; ComponentLink2Description: Datasheet; Category: Cap; Digikey Description: CAP ALUM 100UF 20% 50V SMD; Octopart: https://octopart.com/eeefk1h101p-panasonic-4642841; Automotive: Yes; Temperature: -55°C to +105°C; Capacitance: 100uF; Lead Free: Yes; Mouser Description: Cap Aluminum Lytic 100uF 50V 20% (8 X 10.2mm) SMD 350mA 2000h 105C Automotive T/R; Height: 10.5mm; Device Class L3: Aluminum Electrolytic Capacitors; Value: 100uF; Device Class L1: Passive Components; RoHS: TRUE; Device Class L2: Capacitors; Temperature Range High: +105°C
C42 C46 = CMP-2007-00279-2: as C37 on sheet POWER_RAIL_MONITORING; Device Class L2: Capacitors; Temperature Range Low: -55°C; Voltage Rating: 50 V; Digikey Description: CAP CER 0.1UF 50V X7R 0805; Category: Cap; ComponentLink2Description: Datasheet; Octopart: https://octopart.com/c0805c104k5ractu-kemet-143926; RoHS: TRUE; ComponentLink2URL: https://content.kemet.com/datasheets/KEM_C1003_C0G_SMD.pdf; Temperature Characteristic: X7R; Temperature: -55°C to +125°C; Height: 0.88mm; Temperature Range High: +125°C; Device Class L1: Passive Components; Automotive: No; Lead Free: Yes; Ipc Land Pattern Name: CAPC200125X78; Device Class L3: Ceramic Capacitors; Mouser Description: Cap Ceramic 0.1uF 50V X7R 10% SMD 2.0 x 1.2 mm 125 C Paper T/R; Capacitance: 0.10 μF; Package: C0805C-DN
C43 C47 = CMP-1036-02979-2: as C57 on sheet 19V-PC-POWER
D4 D5 = CMP-12187-000023-1: as D6 on sheet 12V-EXTRA-POWER; Octopart: https://octopart.com/stps3l60u-stmicroelectronics-334329; Category: Diode; Height: 2.65mm; RoHS: TRUE; Mouser Description: Schottky diode Configuration: Single Housing type: DO-214AA=SMB Peak conducting-state current: 100 A; Forward Current: 3A; Manufacturer Part Number: STPS3L60U; Temperature: to +150°C; ComponentLink2URL: https://www.st.com/resource/en/datasheet/stps3l60.pdf; Max Repetitive Reverse Voltage: 60V; Device Class L1: Discrete Semiconductors; Automotive: No; Device Class L3: Schottky Diodes; Digikey Description: DIODE SCHOTTKY 60V 3A SMB; Lead Free: Yes; Temperature Range High: +150°C; Package: SMB; ComponentLink2Description: Datasheet; Device Class L2: Diodes
L3 L4 = CMP-2000-06447-1: Low Profile, High Current IHLP(R) Inductor, 100 uH, +/- 20%, 2.5 A, -55 to 125 degC, 2-Pin SMD, RoHS, Tape and Reel; Manufacturer: Vishay; Qualification: AEC-Q200; Test Frequency: 100kHz; Maximum DC Resistance: 270mOhms; Type: LowProfileHighCurrentIHLPInductor; Inductance: 100uH; Unit Weight: 0.070548oz; Shielding: Shielded; Brand: Vishay/Dale; Maximum DC Current: 2.25A; Termination Style: SMD/SMT; Mounting Style: SMD/SMT; Tolerance: 20%; Factory Pack Quantity: 500; Product Category: FixedInductors; Mounting Technology: SurfaceMount; Manufacturer URL: http://www.vishay.com/; Operating Temperature Range: -55Cto+125C; Datasheet Version: 08/2015; Product: PowerInductors; Packaging: Reel; Length: 10.3mm; Package Description: 2-Pin Surface Mount Device, Body 10.3 x 10.3 mm; Height: 4mm; Width: 10.3mm; Series: IHLP-4040DZ-11; RoHS: True; Package Reference: IHLP4040DZER101M11; Tradename: IHLP; Datasheet URL: http://www.vishay.com/docs/34192/lp40dz11.pdf; Package / Case: 4040
R68 R69 = CMP-2001-00590-1: as R44 on sheet POWER_RAIL_MONITORING
U11 = CMP-0069-00141-3: SIMPLE SWITCHER® 3A Step-Down Voltage Regulator, 5-pin TO-263; Manufacturer: Texas Instruments; PackageTopMarking: NSUZXYTTE#*LM2576*HVS-5.0 P+; PowerWise: N; RoHS: N; PackageDescription: TO-263, Molded, .400 x .390 x .180in, 5 Lead, .067in Pitch, Surface Mount; Code_JEDEC: MO-169-AB; CompType: Switcher; ComponentLink1URL: http://www.ti.com/general/docs/lit/getliterature.tsp?genericPartNumber=LM2576HV&fileType=pdf; ComponentLink1Description: Datasheet URL; PinCount: 5; PackageReference: KTT0005B
U12 U14 = CMP-2000-04989-2: as U16 on sheet 12V-EXTRA-POWER; Mount: Surface Mount; Max Operating Temperature: 85°C; Min Operating Temperature: -40°C; Termination: SMD/SMT; Number of Pins: 8; Accuracy: 1.5%; Current Sensing: 5A; Length: 4.9mm; Package Quantity: 1; REACH SVHC: No SVHC; Packaging: Cut Tape; Series: -; Height: 1.5mm; Width: 3.9mm; Operating Supply Voltage: 5V; Bandwidth: 80kHz; Case/Package: SOIC; Lead Free: Lead Free; Quiescent Current: 10mA; RoHS Compliant: Yes
U13 = CMP-0069-00132-3: SIMPLE SWITCHER® 3A Step-Down Voltage Regulator, 5-pin TO-263; Manufacturer: Texas Instruments; PowerWise: N; PackageTopMarking: NSUZXYTTE#*LM2576*HVS-3.3 P+; PinCount: 5; Code_JEDEC: MO-169-AB; RoHS: N; ComponentLink1URL: http://www.ti.com/general/docs/lit/getliterature.tsp?genericPartNumber=LM2576HV&fileType=pdf; ComponentLink1Description: Datasheet URL; PackageReference: KTT0005B; CompType: Switcher; PackageDescription: TO-263, Molded, .400 x .390 x .180in, 5 Lead, .067in Pitch, Surface Mount

## Sheet RELAYS.SchDoc
size B
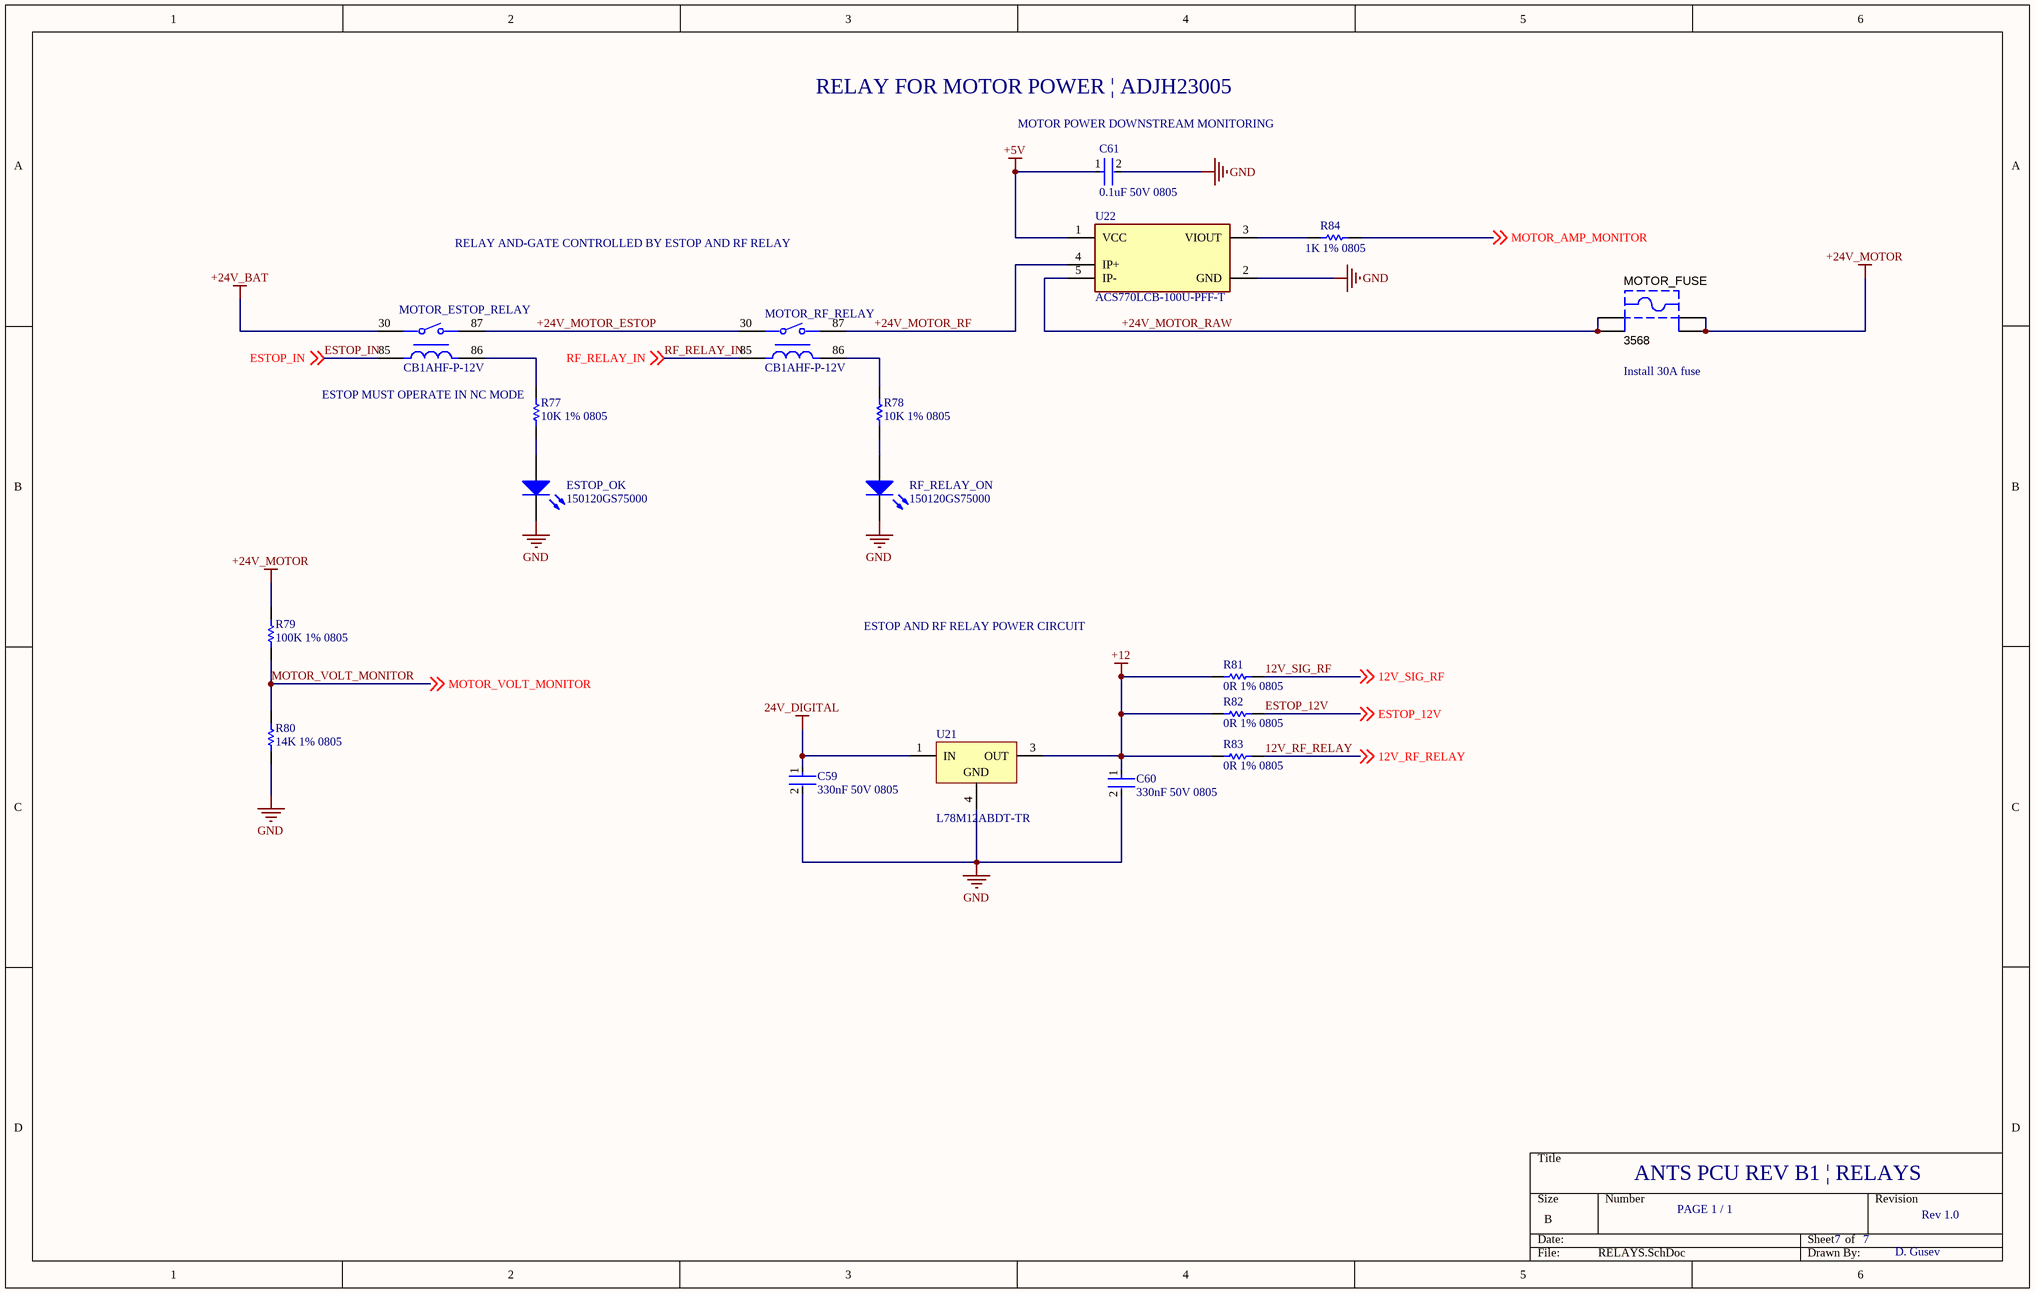
[diagram p10: RELAYS.SchDoc]

### Parts
C59  330nF 50V 0805  [FP-C0805C-DN-MFG]
C60  330nF 50V 0805  [FP-C0805C-DN-MFG]
C61  0.1uF 50V 0805  [FP-C0805C-DN-MFG]
ESTOP_OK  150120GS75000  [1206_A]
MOTOR_ESTOP_RELAY  CB1AHF-P-12V  [FP-CB1AHF-P-12V-MFG]
MOTOR_FUSE  3568  [KSTN-3568_V]
MOTOR_RF_RELAY  CB1AHF-P-12V  [FP-CB1AHF-P-12V-MFG]
R77  10K 1% 0805  [RESC2013X60X35NL10T20]
R78  10K 1% 0805  [RESC2013X60X35NL10T20]
R79  100K 1% 0805  [RESC2013X60X35ML10T20]
R80  14K 1% 0805  [RESC2013X60X35LL10T20]
R81  0R 1% 0805  [RESC2013X60X35LL10T20]
R82  0R 1% 0805  [RESC2013X60X35LL10T20]
R83  0R 1% 0805  [RESC2013X60X35LL10T20]
R84  1K 1% 0805  [RESC2013X60X35ML10T20]
RF_RELAY_ON  150120GS75000  [1206_A]
U21  L78M12ABDT-TR  [TO-252_M]
U22  ACS770LCB-100U-PFF-T  [ACS770LCB-100U-PFF-T]

### Nets
24V_DIGITAL: C59.1 U21.1(IN)  [project net +24V_DIGITAL]
+5V: C61.1 U22.1(VCC)
+12: C60.1 R81.1 R82.1 R83.1 U21.3(OUT)
+24V_BAT: MOTOR_ESTOP_RELAY.30
+24V_MOTOR: MOTOR_FUSE.3 MOTOR_FUSE.4 R79.2
GND: C59.2 C60.2 C61.2 ESTOP_OK.1(K) R80.1 RF_RELAY_ON.1(K) U21.4(GND) U22.2(GND)
12V_RF_RELAY: R83.2 ; off-sheet 12V_RF_RELAY
12V_SIG_RF: R81.2 ; off-sheet 12V_SIG_RF
+24V_MOTOR_ESTOP: MOTOR_ESTOP_RELAY.87 MOTOR_RF_RELAY.30
+24V_MOTOR_RAW: MOTOR_FUSE.1 MOTOR_FUSE.2 U22.5(IP-)
+24V_MOTOR_RF: MOTOR_RF_RELAY.87 U22.4(IP+)
ESTOP_12V: R82.2 ; off-sheet ESTOP_12V
ESTOP_IN: MOTOR_ESTOP_RELAY.85 ; off-sheet ESTOP_IN
MOTOR_AMP_MONITOR: R84.2 ; off-sheet MOTOR_AMP_MONITOR
MOTOR_VOLT_MONITOR: R79.1 R80.2 ; off-sheet MOTOR_VOLT_MONITOR
RF_RELAY_IN: MOTOR_RF_RELAY.85 ; off-sheet RF_RELAY_IN
NetESTOP_OK_2: ESTOP_OK.2(A) R77.1
NetMOTOR_ESTOP_RELAY_86: MOTOR_ESTOP_RELAY.86 R77.2
NetMOTOR_RF_RELAY_86: MOTOR_RF_RELAY.86 R78.2
NetR78_1: R78.1 RF_RELAY_ON.2(A)
NetR84_1: R84.1 U22.3(VIOUT)

### Notes on the sheet
- RELAY FOR MOTOR POWER | ADJH23005
- (near C61) MOTOR POWER DOWNSTREAM MONITORING
- RELAY AND-GATE CONTROLLED BY ESTOP AND RF RELAY
- ESTOP MUST OPERATE IN NC MODE
- (near MOTOR_FUSE) Install 30A fuse
- ESTOP AND RF RELAY POWER CIRCUIT
- ANTS PCU REV B1 | RELAYS
- PAGE 1 / 1
- 7
- Rev 1.0
- D. Gusev

### Library data of the parts
C59 C60 = CMP-1036-04607-3: CAP CER 0.33UF 50V X7R 0805; Manufacturer Part Number: C0805C334K5RACTU; Manufacturer: KEMET; Temperature Coefficient: 30ppm/°C; Value: 0.33 μF; Material: Ceramic; Tolerance: 0.1; Temperature: -55°C to +125°C; Temperature Range Low: -55°C; Voltage Rating: 50 V; Lead Free: Yes; Mouser Description: Multilayer Ceramic Capacitors MLCC - SMD/SMT 50volts 0.33uF 10% X7R; Automotive: No; Package: C0805C-DN; Temperature Characteristic: X7R; Capacitance: 0.33 μF; Digikey Description: CAP CER 0.33UF 50V X7R 0805; Device Class L3: Ceramic Capacitors; Temperature Range High: +125°C; Category: Cap; Ipc Land Pattern Name: CAPC200125X78; ComponentLink2URL: https://content.kemet.com/datasheets/KEM_C1003_C0G_SMD.pdf; ComponentLink2Description: Datasheet; RoHS: TRUE; Device Class L1: Passive Components; Height: 0.88mm; Octopart: https://octopart.com/c0805c334k5ractu-kemet-10475704; Device Class L2: Capacitors
C61 = CMP-2007-00279-2: as C37 on sheet POWER_RAIL_MONITORING; Device Class L2: Capacitors; Temperature Range Low: -55°C; Voltage Rating: 50 V; Digikey Description: CAP CER 0.1UF 50V X7R 0805; Category: Cap; ComponentLink2Description: Datasheet; Octopart: https://octopart.com/c0805c104k5ractu-kemet-143926; RoHS: TRUE; ComponentLink2URL: https://content.kemet.com/datasheets/KEM_C1003_C0G_SMD.pdf; Temperature Characteristic: X7R; Temperature: -55°C to +125°C; Height: 0.88mm; Temperature Range High: +125°C; Device Class L1: Passive Components; Automotive: No; Lead Free: Yes; Ipc Land Pattern Name: CAPC200125X78; Device Class L3: Ceramic Capacitors; Mouser Description: Cap Ceramic 0.1uF 50V X7R 10% SMD 2.0 x 1.2 mm 125 C Paper T/R; Capacitance: 0.10 μF; Package: C0805C-DN
ESTOP_OK RF_RELAY_ON = CMP-1426-00014-1: as 12V_RTR on sheet 12V-EXTRA-POWER; PackageReference: 1206_A; PartNumber: 150120GS75000; ComponentLink1Description: Manufacturer URL; ComponentLink2URL: http://katalog.we-online.com/led/datasheet/150120GS75000.pdf; ComponentLink2Description: Datasheet; Color: Green; ComponentLink1URL: http://www.we-online.com
MOTOR_ESTOP_RELAY MOTOR_RF_RELAY = CMP-05606-000039-1: RELAY AUTOMOTIVE SPST 70A 12V; Power Consumption: 1.4W; Release Time: 15ms; Contact Current Rating: 40A; Max Voltage Rating (DC): 14V; Coil Resistance: 103R; Coil Current: 117mA; Coil Type: Non-Latching; Coil Voltage (DC): 12V; Lead Free: Lead Free; Series: CB; Termination: PC Pin; Coil Power: 1.4W; Max Operating Temperature: 85°C; Relay Type: Automotive; Width: 26.5mm; Mount: Through Hole; Min Operating Temperature: -40°C; Height: 25.5mm; Contact Material: Silver; RoHS Compliant: Yes; Depth: 22mm; Number of Pins: 4; Throw Configuration: SPST; Packaging: Bulk; REACH SVHC: No SVHC; Package Quantity: 50; Operate Time: 15ms; Max Current Rating: 40A; Length: 26mm
MOTOR_FUSE = CMP-2000-05464-1: as PC_FUSE on sheet 19V-PC-POWER; Package Reference: 3568; Datasheet Version: 04/2013; Datasheet URL: https://datasheet.ciiva.com/16294/m60-2p40-16294706.pdf; Manufacturer URL: http://www.keyelco.com/; Mounting Technology: ThroughHole; Package Description: 4-Pin Through Hole Device, Body 16 x 6.73 mm, Pitch 9.9 mm
R77 R78 = CMP-1659-00013-4: as R76 on sheet 19V-PC-POWER; Mount: Surface Mount; ComponentLink1Description: Manufacturer URL; ComponentLink2URL: http://www.yageo.com/documents/recent/PYu-RC_Group_51_RoHS_L_04.pdf; Pins: 2; Length: 2 mm; Min Operating Temperature: -55 degC; Height: 0.5 mm; Mounting Technology: Surface Mount; RoHSCompliant: true; REACH SVHC: No SVHC; ComponentLink1URL: http://www.yageo.com/; Max Operating Temperature: 155 degC; PackageReference: 0805; DatasheetVersion: Rev. 4, 02/2016; Package Quantity: 5000; Packaging: Tape and Reel; ComponentLink2Description: Datasheet; PackageDescription: 2-Pin Surface Mounted Device, Body 2 x 1.25 mm
R79 = CMP-2100-03668-1: as R74 on sheet 19V-PC-POWER; Manufacturer URL: http://www.yageo.com/; Min Operating Temperature: -55degC; Lead Pitch: 0.4mm; Composition: ThickFilm; Case Code (Metric): 2012; Military Standard: Not; Package Description: 2-Pin Surface Mounted Device, Body 2 x 1.25 mm; REACH SVHC: Unknown; RoHSCompliant: true; Depth: 1.25mm; Number of Pins: 2; Lead Free: LeadFree; Resistance: 100KOhm; Datasheet URL: http://www.yageo.com/NewPortal/yageodocoutput?fileName=/pdf/R-Chip/PYu-RC_Group_51_RoHS_L_5.pdf; Max Operating Temperature: 155degC; Case/Package: 0805; Package Quantity: 1; Case Code (Imperial): 0805; Power Rating: 125mW; Width: 0.049inch; Package Reference: 0805; Height: 0.024inch; Termination: SMD/SMT; Tolerance: 1%; Datasheet Version: Rev. 5, 10/2016; Length: 2mm; Voltage Rating (DC): 150V; Number of Terminations: 2; Packaging: TapeandReel
R80 = CMP-1013-00638-2: as R75 on sheet 19V-PC-POWER
R81-R83 = CMP-1659-00014-4: as ADC1 on sheet POWER_RAIL_MONITORING; REACH SVHC: No SVHC; Mounting Technology: Surface Mount; RoHSCompliant: true; Packaging: Tape and Reel; ComponentLink2URL: http://www.yageo.com/documents/recent/PYu-RC_Group_51_RoHS_L_04.pdf; Pins: 2; Package Quantity: 5000; DatasheetVersion: Rev. 4, 02/2016; Mount: Surface Mount; Max Operating Temperature: 155 degC; PackageDescription: 2-Pin Surface Mounted Device, Body 2 x 1.25 mm; PackageReference: 0805; Length: 2 mm; Min Operating Temperature: -55 degC; ComponentLink1URL: http://www.yageo.com/; Height: 0.5 mm; ComponentLink1Description: Manufacturer URL; ComponentLink2Description: Datasheet
R84 = CMP-2100-03671-1: Chip Resistor, 1 KOhm, +/- 1%, 125 mW, -55 to 155 degC, 0805 (2012 Metric), RoHS, Tape and Reel; Manufacturer: Yageo; Temperature Coefficient: 100ppm/degreesC; Voltage Rating (DC): 150V; Max Power Dissipation: 125mW; Resistance: 1KOhm; Number of Pins: 2; Number of Terminations: 2; Datasheet URL: http://www.yageo.com/NewPortal/yageodocoutput?fileName=/pdf/R-Chip/PYu-RC_Group_51_RoHS_L_5.pdf; Length: 0.079inch; Package Description: 2-Pin Surface Mounted Device, Body 2 x 1.25 mm; Depth: 1.25mm; Height: 0.024inch; Military Standard: Not; Case/Package: 0805; Package Reference: 0805; RoHSCompliant: true; Lead Free: LeadFree; Packaging: TapeandReel; Package Quantity: 1; Datasheet Version: Rev. 5, 10/2016; Tolerance: 1%; Min Operating Temperature: -55degC; Voltage Rating: 150V; Composition: ThickFilm; Case Code (Imperial): 0805; Power Rating: 125mW; Width: 0.049inch; Case Code (Metric): 2012; Manufacturer URL: http://www.yageo.com/; Max Operating Temperature: 155degC; REACH SVHC: Unknown; Termination: SMD/SMT
U21 = CMP-0244-00186-1: Precision 500mA Regulator, 12V, 3-Pin DPAK, Tape and Reel; ComponentLink2Description: Datasheet; PackageDescription: 3-Pin Transistor Outline Package 2.28 mm Pitch, 9.7 mm Lead Span (DPAK); PackageVersion: 2011; ComponentLink2URL: http://www.st.com/internet/com/TECHNICAL_RESOURCES/TECHNICAL_LITERATURE/DATASHEET/CD00000448.pdf; ComponentLink1URL: http://www.st.com; PackageReference: TO-252; DatasheetVersion: 1/11/2010; ComponentLink1Description: Manufacturer URL
U22 = ACS770LCB-100U-PFF-T: SENSOR CURRENT HALL 100A DC; Min Input Voltage: 4.5V; Polarity: Unidirectional; Quiescent Current: 10mA; Bandwidth: 120kHz; Max Input Voltage: 5.5V; Sensitivity: 40mV/A; Accuracy: 0.6%; Response Time: 4.6us; Max Supply Current: 15mA; Linearity: 1%; Number of Channels: 1; Max Operating Temperature: 150°C; Package Quantity: 34; Min Operating Temperature: -40°C; Packaging: Rail/Tube; Number of Pins: 5; Width: 13mm; Height: 7mm; Current Sensing: 100A; Length: 14mm; Frequency: 120kHz; Mount: Through Hole

## Sheet CONN.SchDoc
size B
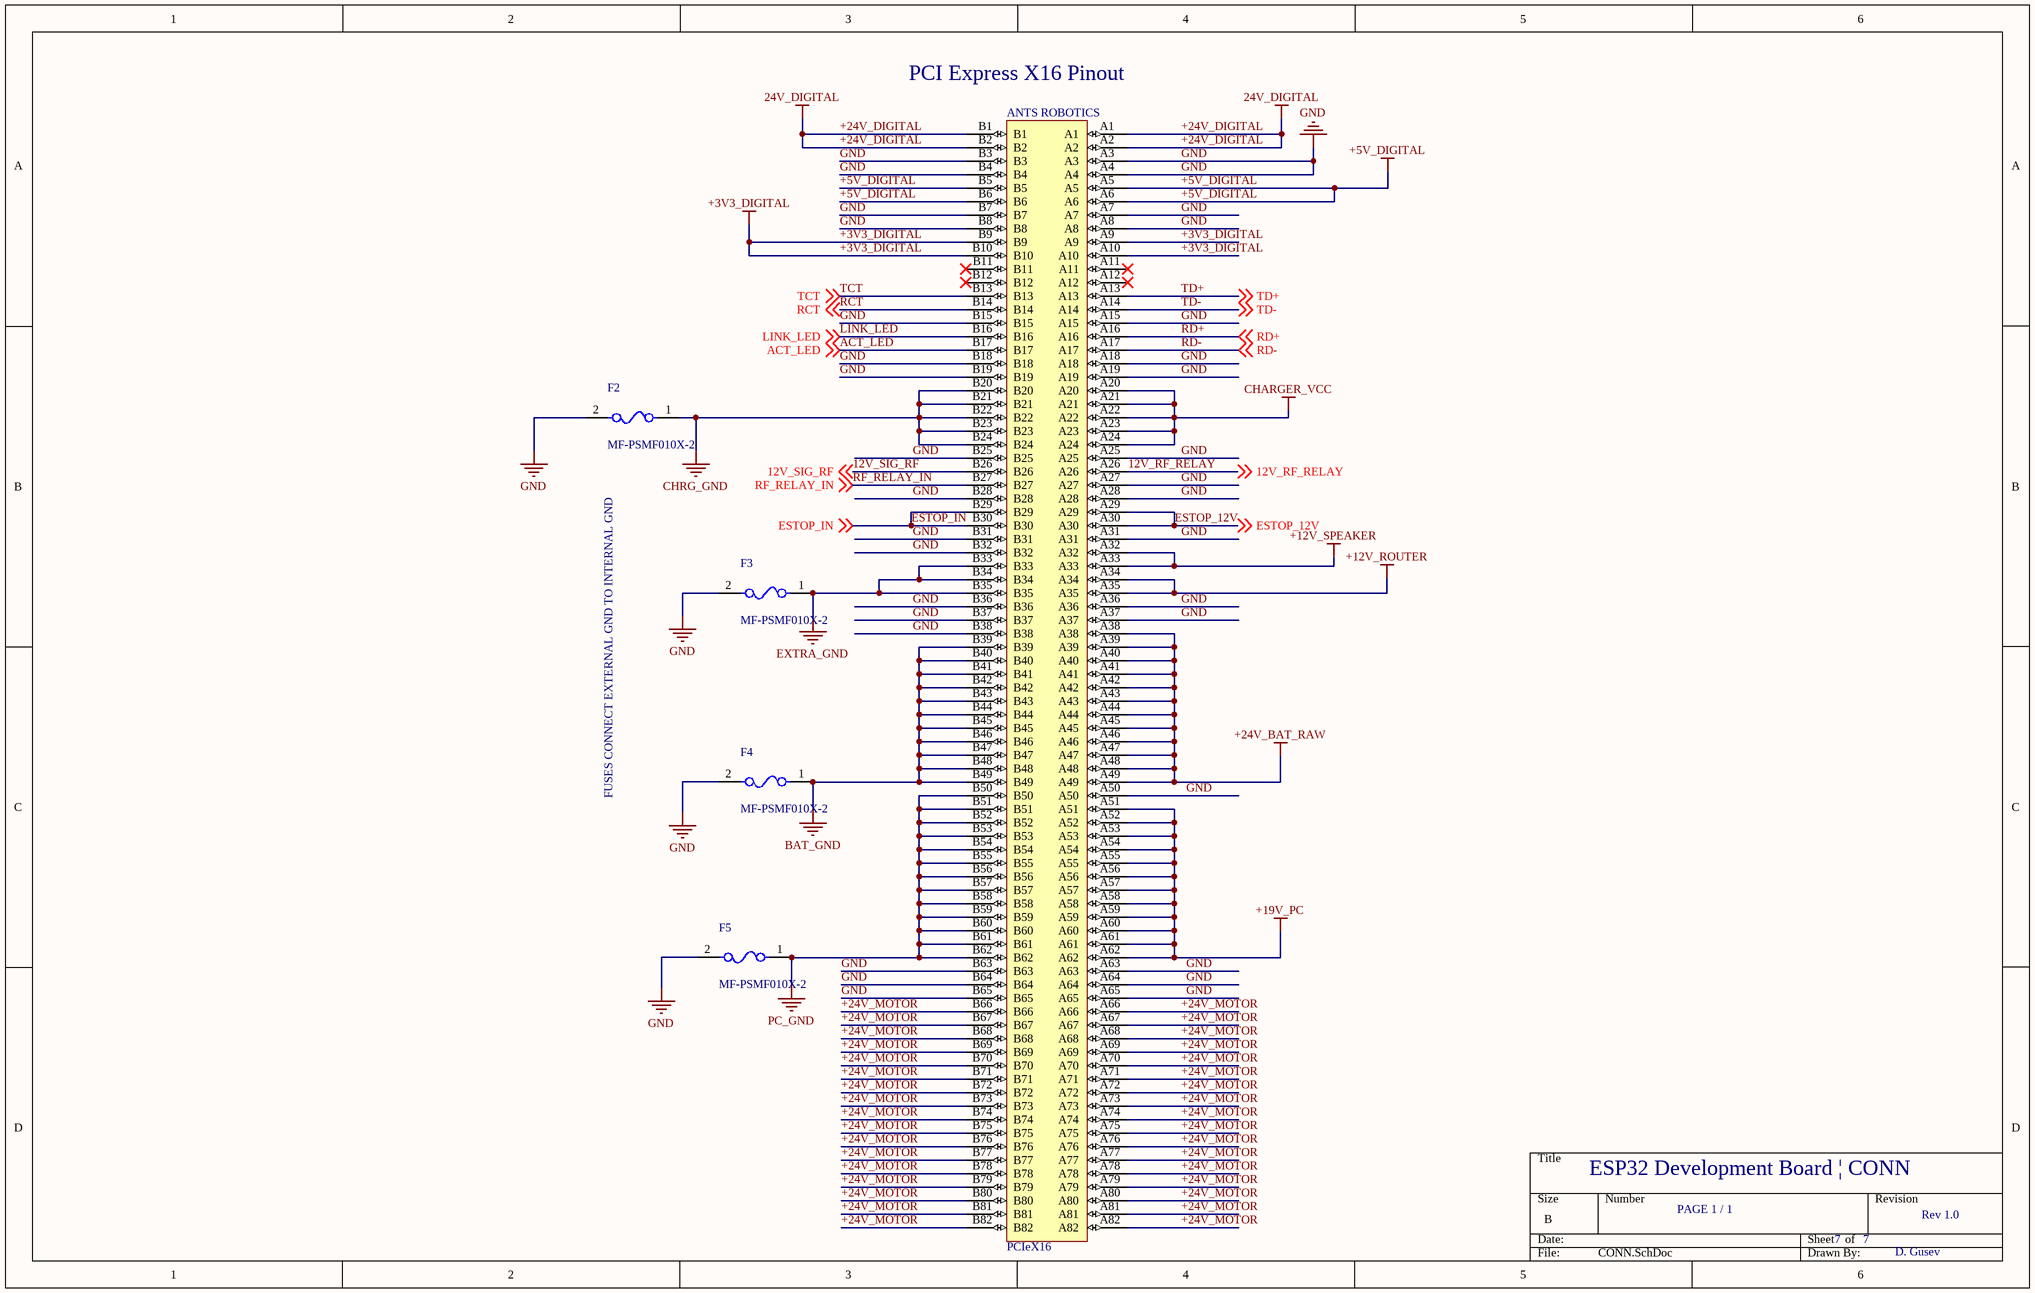
[diagram p11: CONN.SchDoc]

### Parts
ANTS_ROBOTICS  PCIeX16  [PCIeX16]
F2  MF-PSMF010X-2  [FP-MF-PSMF-MFG]
F3  MF-PSMF010X-2  [FP-MF-PSMF-MFG]
F4  MF-PSMF010X-2  [FP-MF-PSMF-MFG]
F5  MF-PSMF010X-2  [FP-MF-PSMF-MFG]

### Nets
+3V3_DIGITAL: ANTS_ROBOTICS.A9 ANTS_ROBOTICS.A10 ANTS_ROBOTICS.B9 ANTS_ROBOTICS.B10
+5V_DIGITAL: ANTS_ROBOTICS.A5 ANTS_ROBOTICS.A6 ANTS_ROBOTICS.B5 ANTS_ROBOTICS.B6
+12V_ROUTER: ANTS_ROBOTICS.A34 ANTS_ROBOTICS.A35
+12V_SPEAKER: ANTS_ROBOTICS.A32 ANTS_ROBOTICS.A33
+19V_PC: ANTS_ROBOTICS.A51 ANTS_ROBOTICS.A52 ANTS_ROBOTICS.A53 ANTS_ROBOTICS.A54 ANTS_ROBOTICS.A55 ANTS_ROBOTICS.A56 ANTS_ROBOTICS.A57 ANTS_ROBOTICS.A58 ANTS_ROBOTICS.A59 ANTS_ROBOTICS.A60 ANTS_ROBOTICS.A61 ANTS_ROBOTICS.A62
+24V_BAT_RAW: ANTS_ROBOTICS.A38 ANTS_ROBOTICS.A39 ANTS_ROBOTICS.A40 ANTS_ROBOTICS.A41 ANTS_ROBOTICS.A42 ANTS_ROBOTICS.A43 ANTS_ROBOTICS.A44 ANTS_ROBOTICS.A45 ANTS_ROBOTICS.A46 ANTS_ROBOTICS.A47 ANTS_ROBOTICS.A48 ANTS_ROBOTICS.A49
+24V_DIGITAL: ANTS_ROBOTICS.A1 ANTS_ROBOTICS.A2 ANTS_ROBOTICS.B1 ANTS_ROBOTICS.B2  [also labelled 24V_DIGITAL]
+24V_MOTOR: ANTS_ROBOTICS.A66 ANTS_ROBOTICS.A67 ANTS_ROBOTICS.A68 ANTS_ROBOTICS.A69 ANTS_ROBOTICS.A70 ANTS_ROBOTICS.A71 ANTS_ROBOTICS.A72 ANTS_ROBOTICS.A73 ANTS_ROBOTICS.A74 ANTS_ROBOTICS.A75 ANTS_ROBOTICS.A76 ANTS_ROBOTICS.A77 ANTS_ROBOTICS.A78 ANTS_ROBOTICS.A79 ANTS_ROBOTICS.A80 ANTS_ROBOTICS.A81 ANTS_ROBOTICS.A82 ANTS_ROBOTICS.B66 ANTS_ROBOTICS.B67 ANTS_ROBOTICS.B68 ANTS_ROBOTICS.B69 ANTS_ROBOTICS.B70 ANTS_ROBOTICS.B71 ANTS_ROBOTICS.B72 ANTS_ROBOTICS.B73 ANTS_ROBOTICS.B74 ANTS_ROBOTICS.B75 ANTS_ROBOTICS.B76 ANTS_ROBOTICS.B77 ANTS_ROBOTICS.B78 ANTS_ROBOTICS.B79 ANTS_ROBOTICS.B80 ANTS_ROBOTICS.B81 ANTS_ROBOTICS.B82
BAT_GND: ANTS_ROBOTICS.B39 ANTS_ROBOTICS.B40 ANTS_ROBOTICS.B41 ANTS_ROBOTICS.B42 ANTS_ROBOTICS.B43 ANTS_ROBOTICS.B44 ANTS_ROBOTICS.B45 ANTS_ROBOTICS.B46 ANTS_ROBOTICS.B47 ANTS_ROBOTICS.B48 ANTS_ROBOTICS.B49 F4.1
CHARGER_VCC: ANTS_ROBOTICS.A20 ANTS_ROBOTICS.A21 ANTS_ROBOTICS.A22 ANTS_ROBOTICS.A23 ANTS_ROBOTICS.A24
CHRG_GND: ANTS_ROBOTICS.B20 ANTS_ROBOTICS.B21 ANTS_ROBOTICS.B22 ANTS_ROBOTICS.B23 ANTS_ROBOTICS.B24 F2.1
EXTRA_GND: ANTS_ROBOTICS.B33 ANTS_ROBOTICS.B34 ANTS_ROBOTICS.B35 F3.1
GND: ANTS_ROBOTICS.A3 ANTS_ROBOTICS.A4 ANTS_ROBOTICS.A7 ANTS_ROBOTICS.A8 ANTS_ROBOTICS.A15 ANTS_ROBOTICS.A18 ANTS_ROBOTICS.A19 ANTS_ROBOTICS.A25 ANTS_ROBOTICS.A27 ANTS_ROBOTICS.A28 ANTS_ROBOTICS.A31 ANTS_ROBOTICS.A36 ANTS_ROBOTICS.A37 ANTS_ROBOTICS.A50 ANTS_ROBOTICS.A63 ANTS_ROBOTICS.A64 ANTS_ROBOTICS.A65 ANTS_ROBOTICS.B3 ANTS_ROBOTICS.B4 ANTS_ROBOTICS.B7 ANTS_ROBOTICS.B8 ANTS_ROBOTICS.B15 ANTS_ROBOTICS.B18 ANTS_ROBOTICS.B19 ANTS_ROBOTICS.B25 ANTS_ROBOTICS.B28 ANTS_ROBOTICS.B31 ANTS_ROBOTICS.B32 ANTS_ROBOTICS.B36 ANTS_ROBOTICS.B37 ANTS_ROBOTICS.B38 ANTS_ROBOTICS.B63 ANTS_ROBOTICS.B64 ANTS_ROBOTICS.B65 F2.2 F3.2 F4.2 F5.2
PC_GND: ANTS_ROBOTICS.B50 ANTS_ROBOTICS.B51 ANTS_ROBOTICS.B52 ANTS_ROBOTICS.B53 ANTS_ROBOTICS.B54 ANTS_ROBOTICS.B55 ANTS_ROBOTICS.B56 ANTS_ROBOTICS.B57 ANTS_ROBOTICS.B58 ANTS_ROBOTICS.B59 ANTS_ROBOTICS.B60 ANTS_ROBOTICS.B61 ANTS_ROBOTICS.B62 F5.1
12V_RF_RELAY: ANTS_ROBOTICS.A26 ; off-sheet 12V_RF_RELAY
12V_SIG_RF: ANTS_ROBOTICS.B26 ; off-sheet 12V_SIG_RF
ACT_LED: ANTS_ROBOTICS.B17 ; off-sheet ACT_LED
ESTOP_12V: ANTS_ROBOTICS.A29 ANTS_ROBOTICS.A30 ; off-sheet ESTOP_12V
ESTOP_IN: ANTS_ROBOTICS.B29 ANTS_ROBOTICS.B30 ; off-sheet ESTOP_IN
LINK_LED: ANTS_ROBOTICS.B16 ; off-sheet LINK_LED
RCT: ANTS_ROBOTICS.B14 ; off-sheet RCT
RD+: ANTS_ROBOTICS.A16 ; off-sheet RD+
RD-: ANTS_ROBOTICS.A17 ; off-sheet RD-
RF_RELAY_IN: ANTS_ROBOTICS.B27 ; off-sheet RF_RELAY_IN
TCT: ANTS_ROBOTICS.B13 ; off-sheet TCT
TD+: ANTS_ROBOTICS.A13 ; off-sheet TD+
TD-: ANTS_ROBOTICS.A14 ; off-sheet TD-

Not connected (* = marked no-connect by the designer): ANTS_ROBOTICS A11* A12* B11* B12*

### Notes on the sheet
- (near ANTS_ROBOTICS) PCI Express X16 Pinout
- FUSES CONNECT EXTERNAL GND TO INTERNAL GND
- ESP32 Development Board | CONN
- PAGE 1 / 1
- 7
- Rev 1.0
- D. Gusev

### Library data of the parts
ANTS_ROBOTICS = PCIeX16: Golden finger, PCIeX16, Dual, Opposite, Pitch 1mm, 164-Position
F2-F5 = CMP-07400-000017-1: PTC RESET FUSE 15V 100MA 0805; Manufacturer: Bourns Inc.; Resistance: 1-7.5Ω; Value: 1-7.5Ω; Current Rating: 40A; Hold Current: 0.1A; Trip Current: 0.3A; Trip Time: 1.5s; Temperature: -40°C to +85°C; ComponentLink2Description: Datasheet; Lead Free: Yes; Ipc Land Pattern Name: CAPC215135X67; Device Class L1: Circuit Protection; Mouser Description: Resettable Fuses - PPTC 0.10A 15V 1ohm; Automotive: No; Octopart: https://octopart.com/mf-psmf010x-2-bourns-7483441; Manufacturer Part Number: MF-PSMF010X-2; RoHS: TRUE; Temperature Range High: +85°C; Digikey Description: PTC RESET FUSE 15V 100MA 0805; Device Class L3: unset; ComponentLink2URL: https://www.bourns.com/docs/Product-Datasheets/mfpsmf.pdf; Height: 0.85mm; Voltage Rating: 15V; Ambient Temperature Range Low: -40°C; Category: Fuse; Package: MF-PSMF; Temperature Range Low: -40°C; Device Class L2: PTC Resettable Fuses; Ambient Temperature Range High: +85°C

## Nets that join several sheets
+3V3: USB-ESP32 (R3#1.1 R4#1.1), ESP32 (C7.1 ESP32.2 R12.2 R13.2), ESP32-POWER (C6.1 R8#1.2 U2.2 U2.4), BATTERY-CONTROL (5 pins), POWER_RAIL_CTRL (8 pins), POWER_RAIL_MONITORING (R44.2 R45.2)
+3V3_DIGITAL: +5V_3V3_DIGITAL (3V3D_FUSE.2 R68.2), CONN (ANTS_ROBOTICS.A9 ANTS_ROBOTICS.A10 ANTS_ROBOTICS.B9 ANTS_ROBOTICS.B10)
+5V: USB-ESP32 (C2#1.1 C3#1.1 F-USB.2 U1.15), ESP32-POWER (6 pins), BATTERY-CONTROL (C35.1 U6.1), POWER_RAIL_MONITORING (18 pins), 19V-PC-POWER (C56.1 U20.8), 12V-EXTRA-POWER (C50.1 C54.1 U16.8 U18.8), +5V_3V3_DIGITAL (C42.1 C46.1 U12.8 U14.8), RELAYS (C61.1 U22.1)
+5V_DIGITAL: +5V_3V3_DIGITAL (5VD_FUSE.2 R69.2), CONN (ANTS_ROBOTICS.A5 ANTS_ROBOTICS.A6 ANTS_ROBOTICS.B5 ANTS_ROBOTICS.B6)
+12V_ROUTER: 12V-EXTRA-POWER (R71.2 RTR_FUSE.2), CONN (ANTS_ROBOTICS.A34 ANTS_ROBOTICS.A35)
+12V_SPEAKER: 12V-EXTRA-POWER (R70.2 SPKR_FUSE.2), CONN (ANTS_ROBOTICS.A32 ANTS_ROBOTICS.A33)
+19V_PC: 19V-PC-POWER (PC_FUSE.1 PC_FUSE.2 R76.1), CONN (12 pins)
+24V_BAT: BATTERY-CONTROL (24VD_FUSE.1 24VD_FUSE.2 R37.2 U6.5), 12V-EXTRA-POWER (C48.2 C52.2 U15.1 U17.1), +5V_3V3_DIGITAL (C40.2 C44.2 U11.1 U13.1), RELAYS (MOTOR_ESTOP_RELAY.30)
+24V_BAT_FUSE: ESP32-POWER (C8.1 U3.3 U3.4), BATTERY-CONTROL (BAT-RAW.1 BAT-RAW.2 U6.4)
+24V_BAT_RAW: BATTERY-CONTROL (BAT-RAW.3 BAT-RAW.4 BAT_CHRG_RELAY.3), CONN (12 pins)
+24V_DIGITAL: BATTERY-CONTROL (24VD_FUSE.3 24VD_FUSE.4), 19V-PC-POWER (PC_BUCK.6 PC_BUCK.7 PC_BUCK.8), RELAYS (C59.1 U21.1), CONN (ANTS_ROBOTICS.A1 ANTS_ROBOTICS.A2 ANTS_ROBOTICS.B1 ANTS_ROBOTICS.B2)
+24V_MOTOR: RELAYS (MOTOR_FUSE.3 MOTOR_FUSE.4 R79.2), CONN (34 pins)
CHARGER_VCC: BATTERY-CONTROL (BAT_CHRG_RELAY.1 R34.2), CONN (5 pins)
GND: USB-ESP32 (16 pins), ESP32 (7 pins), ESP32-POWER (10 pins), Ethernet (8 pins), BATTERY-CONTROL (8 pins), POWER_RAIL_CTRL (6 pins), POWER_RAIL_MONITORING (24 pins), 19V-PC-POWER (7 pins), 12V-EXTRA-POWER (18 pins), +5V_3V3_DIGITAL (18 pins), RELAYS (8 pins), CONN (38 pins)
3V3D_AMP_MONITOR: POWER_RAIL_MONITORING (U9.3), +5V_3V3_DIGITAL (U14.7)
5VD_AMP_MONITOR: POWER_RAIL_MONITORING (U9.2), +5V_3V3_DIGITAL (U12.7)
12V_RF_RELAY: RELAYS (R83.2), CONN (ANTS_ROBOTICS.A26)
12V_SIG_RF: RELAYS (R81.2), CONN (ANTS_ROBOTICS.B26)
+3V3_DIGITAL_ENABLE: POWER_RAIL_CTRL (U7.11), +5V_3V3_DIGITAL (U13.5)
+5V_DIGITAL_ENABLE: POWER_RAIL_CTRL (U7.8), +5V_3V3_DIGITAL (U11.5)
+12V_EXTRA_ENABLE: POWER_RAIL_CTRL (U7.6), 12V-EXTRA-POWER (U15.5 U17.5)
BAT_AMP_MONITOR: BATTERY-CONTROL (R39.2), POWER_RAIL_MONITORING (U8.2)
BAT_CHRG_EN: ESP32 (ESP32.28), BATTERY-CONTROL (R32.1)
BAT_VOLT_MONITOR: BATTERY-CONTROL (R37.1 R38.2), POWER_RAIL_MONITORING (U8.1)
CHRG_DET_3V3: ESP32 (ESP32.11), BATTERY-CONTROL (U5.4)
ESP32-I2C-SCL: ESP32 (ESP32.36), POWER_RAIL_MONITORING (R44.1 U8.9 U9.9 U10.9)
ESP32-I2C-SDA: ESP32 (ESP32.33), POWER_RAIL_MONITORING (R45.1 U8.10 U9.10 U10.10)
ESP32_3V3D_EN: ESP32 (ESP32.27), POWER_RAIL_CTRL (R40.2 U7.13)
ESP32_5VD_EN: ESP32 (ESP32.23), POWER_RAIL_CTRL (R41.2 U7.10)
ESP32_12V_EN: ESP32 (ESP32.13), POWER_RAIL_CTRL (12V_AUTO.1)
ESP32_RX: USB-ESP32 (U1.20), ESP32 (ESP32.34)
ESP32_SYS_RDY: ESP32 (ESP32.16), POWER_RAIL_CTRL (R43.2 U7.2)
ESP32_TX: USB-ESP32 (U1.4), ESP32 (ESP32.35)
ESTOP_12V: RELAYS (R82.2), CONN (ANTS_ROBOTICS.A29 ANTS_ROBOTICS.A30)
ESTOP_IN: RELAYS (MOTOR_ESTOP_RELAY.85), CONN (ANTS_ROBOTICS.B29 ANTS_ROBOTICS.B30)
GPIO0: USB-ESP32 (Q2.3), ESP32 (ESP32.25 ESP32_BOOT.2 R13.1)
MOTOR_AMP_MONITOR: POWER_RAIL_MONITORING (U10.3 U10.4), RELAYS (R84.2)
MOTOR_VOLT_MONITOR: POWER_RAIL_MONITORING (U10.1 U10.2), RELAYS (R79.1 R80.2)
PC_AMP_MONITOR: POWER_RAIL_MONITORING (U8.4), 19V-PC-POWER (U20.7)
PC_VOLT_MONITOR: POWER_RAIL_MONITORING (U8.3), 19V-PC-POWER (R74.1 R75.2)
RESET: USB-ESP32 (Q1.3), ESP32 (ESP32.3 ESP32_RESET.2 R12.1)
RF_RELAY_IN: RELAYS (MOTOR_RF_RELAY.85), CONN (ANTS_ROBOTICS.B27)
ROUTER_AMP_MONITOR: POWER_RAIL_MONITORING (U9.4), 12V-EXTRA-POWER (U18.7)
SPEAKER_AMP_MONITOR: POWER_RAIL_MONITORING (U9.1), 12V-EXTRA-POWER (U16.7)